# Altium project SZG-TEMPLATE-TXR.PRJPCB
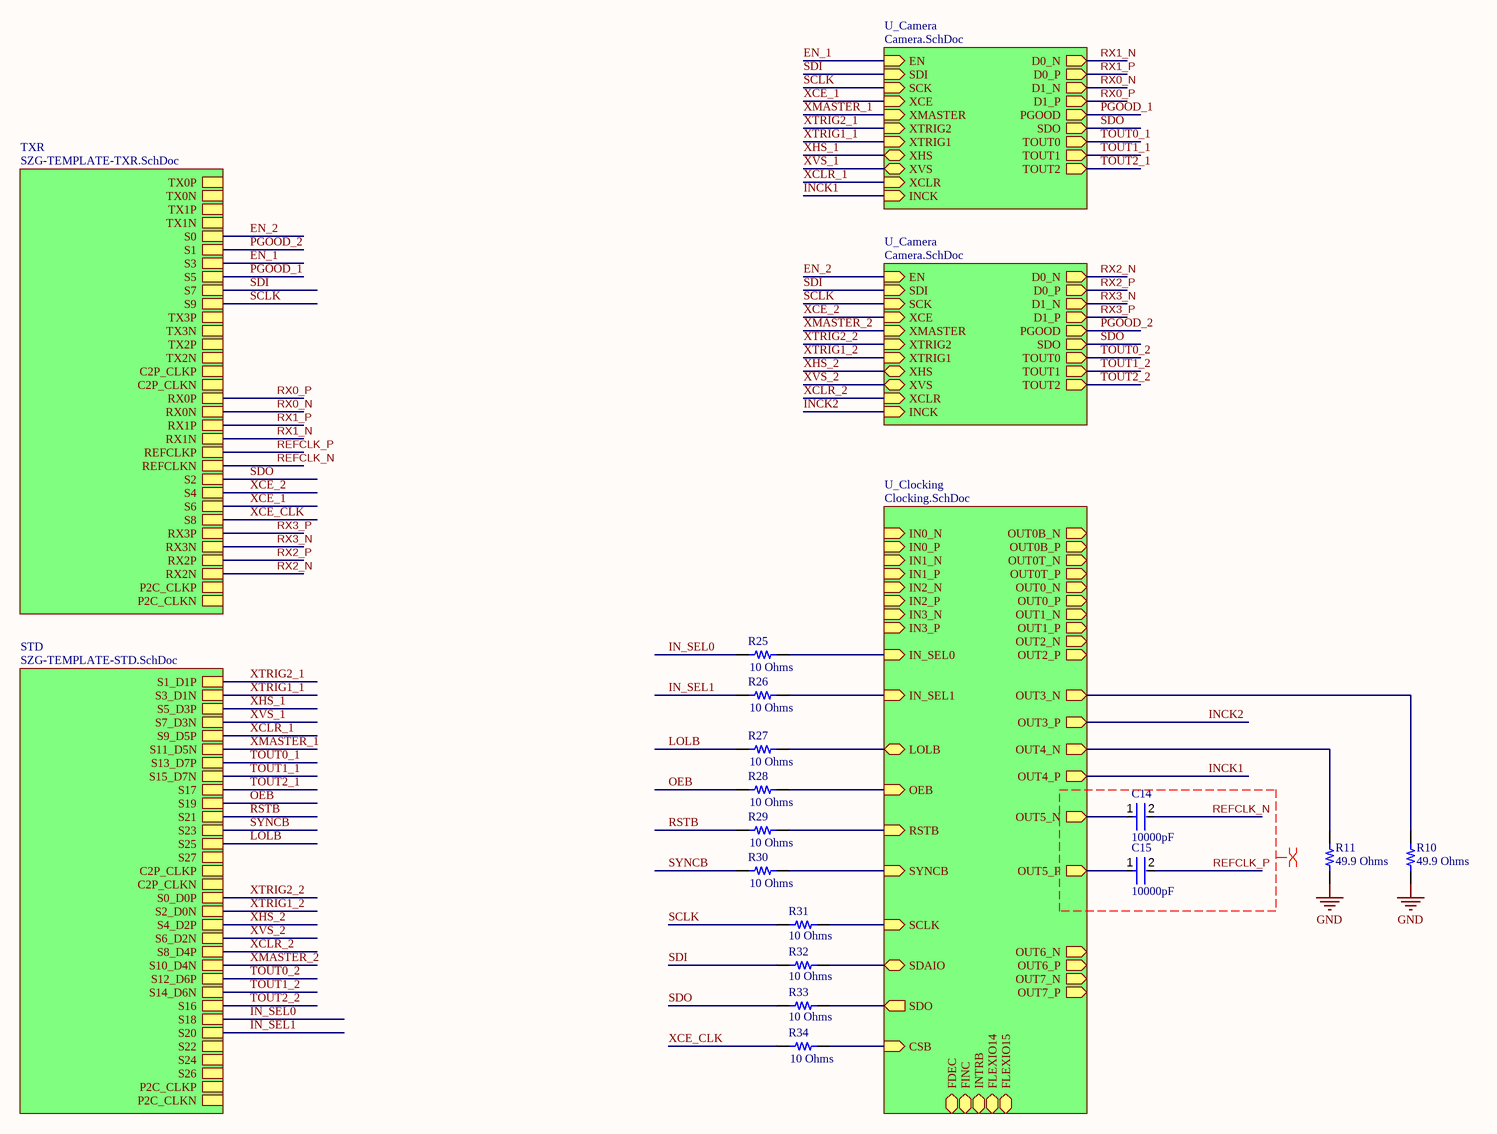
[diagram p0: Main.SchDoc]
7 sheets, 107 parts. Net scope: hierarchical (ports join the sheet entries above them; power ports are global).
Board file: Doublewide.PcbDoc
Sheets:
  Main.SchDoc
    U_Camera = Camera.SchDoc
    U_Clocking = Clocking.SchDoc
      SUPPLY1 = ADP7157-1V8.SchDoc
      SUPPLY3 = ADP151-1V8.SchDoc
      SUPPLY4 = ADP151-1V8.SchDoc
    TXR = SZG-TEMPLATE-TXR.SchDoc
    STD = SZG-TEMPLATE-STD.SchDoc
    U_Camera = Camera.SchDoc

## Sheet Main.SchDoc
size 431 x 279 mm; Organization: ORGANIZATION; Address1: ADDRESS 1; Address2: ADDRESS 2; Address3: ADDRESS 3; Address4: ADDRESS 4; Revision: -; SheetNumber: 1; SheetTotal: 8; ENG_APP_DATE: --/--/--; DSN_APP_DATE: --/--/--; CHK_APP_DATE: --/--/--

### Parts
C14  10000pF  [FP-GRM033-0_03-MFG]
C15  10000pF  [FP-GRM033-0_03-MFG]
R10  49.9 Ohms  [RES 0402_1005]
R11  49.9 Ohms  [RES 0402_1005]
R25  10 Ohms  [RES 0201_0603]
R26  10 Ohms  [RES 0201_0603]
R27  10 Ohms  [RES 0201_0603]
R28  10 Ohms  [RES 0201_0603]
R29  10 Ohms  [RES 0201_0603]
R30  10 Ohms  [RES 0201_0603]
R31  10 Ohms  [RES 0201_0603]
R32  10 Ohms  [RES 0201_0603]
R33  10 Ohms  [RES 0201_0603]
R34  10 Ohms  [RES 0201_0603]

### Sub-sheets
STD = SZG-TEMPLATE-STD.SchDoc: S1_D1P, S3_D1N, S5_D3P, S7_D3N, S9_D5P, S11_D5N, S13_D7P, S15_D7N, S17, S19, S21, S23, S25, S27, C2P_CLKP, C2P_CLKN, S0_D0P, S2_D0N, S4_D2P, S6_D2N, S8_D4P, S10_D4N, S12_D6P, S14_D6N, S16, S18, S20, S22, S24, S26, P2C_CLKP, P2C_CLKN
TXR = SZG-TEMPLATE-TXR.SchDoc: TX0P, TX0N, TX1P, TX1N, S0, S1, S3, S5, S7, S9, TX3P, TX3N, TX2P, TX2N, C2P_CLKP, C2P_CLKN, RX0P, RX0N, RX1P, RX1N, REFCLKP, REFCLKN, S2, S4, S6, S8, RX3P, RX3N, RX2P, RX2N, P2C_CLKP, P2C_CLKN
U_Camera = Camera.SchDoc: D0_N (out), D0_P (out), D1_N (out), D1_P (out), EN (in), PGOOD (out), SDI (in), SCK (in), SDO (out), XCE (in), XMASTER (in), TOUT0 (out), TOUT1 (out), TOUT2 (out), XTRIG2 (in), XTRIG1 (in), XHS (bidir), XVS (bidir), XCLR (in), INCK (in)
U_Camera = Camera.SchDoc: D0_N (out), D0_P (out), D1_N (out), D1_P (out), EN (in), PGOOD (out), SDI (in), SCK (in), SDO (out), XCE (in), XMASTER (in), TOUT0 (out), TOUT1 (out), TOUT2 (out), XTRIG2 (in), XTRIG1 (in), XHS (bidir), XVS (bidir), XCLR (in), INCK (in)
U_Clocking = Clocking.SchDoc: CSB (in), FDEC (bidir), FINC (bidir), FLEXIO14 (bidir), FLEXIO15 (bidir), INTRB (bidir), IN_SEL0 (in), IN_SEL1 (in), LOLB (bidir), OEB (in), RSTB (in), SCLK (in), SDAIO (bidir), SDO (out), SYNCB (in), OUT0B_N (out), OUT0B_P (out), OUT0T_N (out), OUT0T_P (out), OUT0_N (out), OUT0_P (out), OUT1_N (out), OUT1_P (out), OUT2_N (out), OUT2_P (out), OUT3_N (out), OUT3_P (out), OUT4_N (out), OUT4_P (out), OUT5_N (out), OUT5_P (out), OUT6_N (out), OUT6_P (out), OUT7_N (out), OUT7_P (out), IN0_N (in), IN0_P (in), IN1_N (in), IN1_P (in), IN2_N (in), IN2_P (in), IN3_N (in), IN3_P (in)

### Nets
GND: R10.1 R11.1
CSB: R34.2 ; sheet U_Clocking/CSB
EN_1: sheet U_Camera/EN, sheet TXR/S3
EN_2: sheet TXR/S0, sheet U_Camera/EN
IN_SEL0: R25.2 ; sheet U_Clocking/IN_SEL0
IN_SEL0: R25.1 ; sheet STD/S18  [a separate net that carries the same name]
IN_SEL1: R26.2 ; sheet U_Clocking/IN_SEL1
IN_SEL1: R26.1 ; sheet STD/S20  [a separate net that carries the same name]
INCK1: sheet U_Camera/INCK, sheet U_Clocking/OUT4_P
INCK2: sheet U_Clocking/OUT3_P, sheet U_Camera/INCK
LOLB: R27.2 ; sheet U_Clocking/LOLB
LOLB: R27.1 ; sheet STD/S25  [a separate net that carries the same name]
OEB: R28.2 ; sheet U_Clocking/OEB
OEB: R28.1 ; sheet STD/S19  [a separate net that carries the same name]
OUT3_N: R10.2 ; sheet U_Clocking/OUT3_N
OUT4_N: R11.2 ; sheet U_Clocking/OUT4_N
OUT5_N: C14.1 ; sheet U_Clocking/OUT5_N
OUT5_P: C15.1 ; sheet U_Clocking/OUT5_P
PGOOD_1: sheet U_Camera/PGOOD, sheet TXR/S5
PGOOD_2: sheet TXR/S1, sheet U_Camera/PGOOD
REFCLK_N: C14.2 ; sheet TXR/REFCLKN
REFCLK_P: C15.2 ; sheet TXR/REFCLKP
RSTB: R29.2 ; sheet U_Clocking/RSTB
RSTB: R29.1 ; sheet STD/S21  [a separate net that carries the same name]
RX0_N: sheet U_Camera/D1_N, sheet TXR/RX0N
RX0_P: sheet U_Camera/D1_P, sheet TXR/RX0P
RX1_N: sheet U_Camera/D0_N, sheet TXR/RX1N
RX1_P: sheet U_Camera/D0_P, sheet TXR/RX1P
RX2_N: sheet TXR/RX2N, sheet U_Camera/D0_N
RX2_P: sheet TXR/RX2P, sheet U_Camera/D0_P
RX3_N: sheet TXR/RX3N, sheet U_Camera/D1_N
RX3_P: sheet TXR/RX3P, sheet U_Camera/D1_P
SCLK: R31.2 ; sheet U_Clocking/SCLK
SCLK: R31.1 ; sheet U_Camera/SCK, sheet TXR/S9, sheet U_Camera/SCK  [a separate net that carries the same name]
SDAIO: R32.2 ; sheet U_Clocking/SDAIO
SDI: R32.1 ; sheet U_Camera/SDI, sheet TXR/S7, sheet U_Camera/SDI
SDO: R33.2 ; sheet U_Clocking/SDO
SDO: R33.1 ; sheet U_Camera/SDO, sheet TXR/S2, sheet U_Camera/SDO  [a separate net that carries the same name]
SYNCB: R30.2 ; sheet U_Clocking/SYNCB
SYNCB: R30.1 ; sheet STD/S23  [a separate net that carries the same name]
TOUT0_1: sheet U_Camera/TOUT0, sheet STD/S13_D7P
TOUT0_2: sheet STD/S12_D6P, sheet U_Camera/TOUT0
TOUT1_1: sheet U_Camera/TOUT1, sheet STD/S15_D7N
TOUT1_2: sheet STD/S14_D6N, sheet U_Camera/TOUT1
TOUT2_1: sheet U_Camera/TOUT2, sheet STD/S17
TOUT2_2: sheet STD/S16, sheet U_Camera/TOUT2
XCE_1: sheet U_Camera/XCE, sheet TXR/S6
XCE_2: sheet TXR/S4, sheet U_Camera/XCE
XCE_CLK: R34.1 ; sheet TXR/S8
XCLR_1: sheet U_Camera/XCLR, sheet STD/S9_D5P
XCLR_2: sheet STD/S8_D4P, sheet U_Camera/XCLR
XHS_1: sheet U_Camera/XHS, sheet STD/S5_D3P
XHS_2: sheet STD/S4_D2P, sheet U_Camera/XHS
XMASTER_1: sheet U_Camera/XMASTER, sheet STD/S11_D5N
XMASTER_2: sheet STD/S10_D4N, sheet U_Camera/XMASTER
XTRIG1_1: sheet U_Camera/XTRIG1, sheet STD/S3_D1N
XTRIG1_2: sheet STD/S2_D0N, sheet U_Camera/XTRIG1
XTRIG2_1: sheet U_Camera/XTRIG2, sheet STD/S1_D1P
XTRIG2_2: sheet STD/S0_D0P, sheet U_Camera/XTRIG2
XVS_1: sheet U_Camera/XVS, sheet STD/S7_D3N
XVS_2: sheet STD/S6_D2N, sheet U_Camera/XVS

### Layout directives
differential pair; net class REFCLK; differential pair class REFCLK: REFCLK_N, REFCLK_P

### Notes on the sheet
- DWG. NO.
- REV.
- SHT.
- REVISION
- DESCRIPTION
- DATE
- APPROVED
- ENG:
- APPROVALS
- PROJECT
- DSN:
- CHK:
- REFERENCE DOCUMENTS
- PROJECT REVISION:
- TITLE
- SimulaVR
- DOCUMENT REVISION:
- DESIGN ITEM:
- BOM:
- FAB DWG:
- PCB DWG:
- ASSY DWG:
- SCALE:
- SIZE
- B
- CAGE CODE
- FILE NAME
- DWG NO.
- SHEET
- OF
- REV

### Library data of the parts
C14 C15 = CMP-001-00084-1: CAP CER 10000PF 25V X5R 0201
R10 R11 = ERJ-2RKF49R9X: RES SMD 49.9 OHM 1% 1/10W 0402; Manufacturer: Panasonic Electronic Components; Power (Watts): 0.1W, 1/10W; Temperature Coefficient: ±100ppm/°C; Part Number: ERJ-2RKF49R9X; Value: 49.9 Ohms; ComponentLink1Description: Datasheet; ComponentLink1URL: https://industrial.panasonic.com/cdbs/www-data/pdf/RDA0000/AOA0000C304.pdf; ComponentLink2Description: DigiKey Link; ComponentLink2URL: https://www.digikey.com/en/products/detail/panasonic-electronic-components/ERJ-2RKF49R9X/192382; Composition: Thick Film; Device Package: 0402 (1005 Metric); Features: Automotive AEC-Q200; Height - Seated (Max): 0.016" (0.40mm); LastUpdated: 8/11/2022 9:07:22 AM; Lifecycle Status: Active; Minimum Order: 1; Number of Terminations: 2; Operating Temperature: -55°C ~ 155°C; Package / Case: 0402 (1005 Metric); Packaging: CutTape; PartId: 17623; Part Status: Active; Price: 0.01; Ratings: AEC-Q200; Resistance: 49.9 Ohms; Series: ERJ-2RK; Size / Dimension: 0.039" L x 0.020" W (1.00mm x 0.50mm); Supplier 1: DigiKey; Supplier Part Number 1: P49.9LCT-ND; Supplier Device Package: 0402; Tolerance: ±1%
R25-R34 = CRG0201F10R: RES SMD 10 OHM 1% 1/20W 0201; Manufacturer: TE Connectivity Passive Product; Power (Watts): 0.05W, 1/20W; Temperature Coefficient: ±400ppm/°C; Part Number: CRG0201F10R; Value: 10 Ohms; ComponentLink1Description: Datasheet; ComponentLink1URL: https://www.te.com/commerce/DocumentDelivery/DDEController?Action=srchrtrv&DocNm=1773204&DocType=DS&DocLang=English; ComponentLink2Description: DigiKey Link; ComponentLink2URL: https://www.digikey.com/en/products/detail/te-connectivity-passive-product/CRG0201F10R/4489648; Composition: Thick Film; Device Package: 0201 (0603 Metric); Height - Seated (Max): 0.010" (0.26mm); LastUpdated: 8/11/2022 9:03:27 AM; Lifecycle Status: Active; Minimum Order: 1; Number of Terminations: 2; Operating Temperature: -55°C ~ 155°C; Package / Case: 0201 (0603 Metric); Packaging: TapeAndReel; PartId: 3; Part Status: Active; Price: 0.03; Resistance: 10 Ohms; Series: CRG, Neohm; Size / Dimension: 0.024" L x 0.012" W (0.60mm x 0.30mm); Supplier 1: DigiKey; Supplier Part Number 1: A129573CT-ND; Supplier Device Package: 0201; Tolerance: ±1%

## Sheet Camera.SchDoc
size 431 x 279 mm; Organization: ORGANIZATION; Address1: ADDRESS 1; Address2: ADDRESS 2; Address3: ADDRESS 3; Address4: ADDRESS 4; Revision: -; SheetNumber: 4; SheetTotal: 8; ENG_APP_DATE: --/--/--; DSN_APP_DATE: --/--/--; CHK_APP_DATE: --/--/--
Used 2 times, as channels U_Camera, U_Camera. Parts and nets are listed once, with the designators drawn on the sheet.
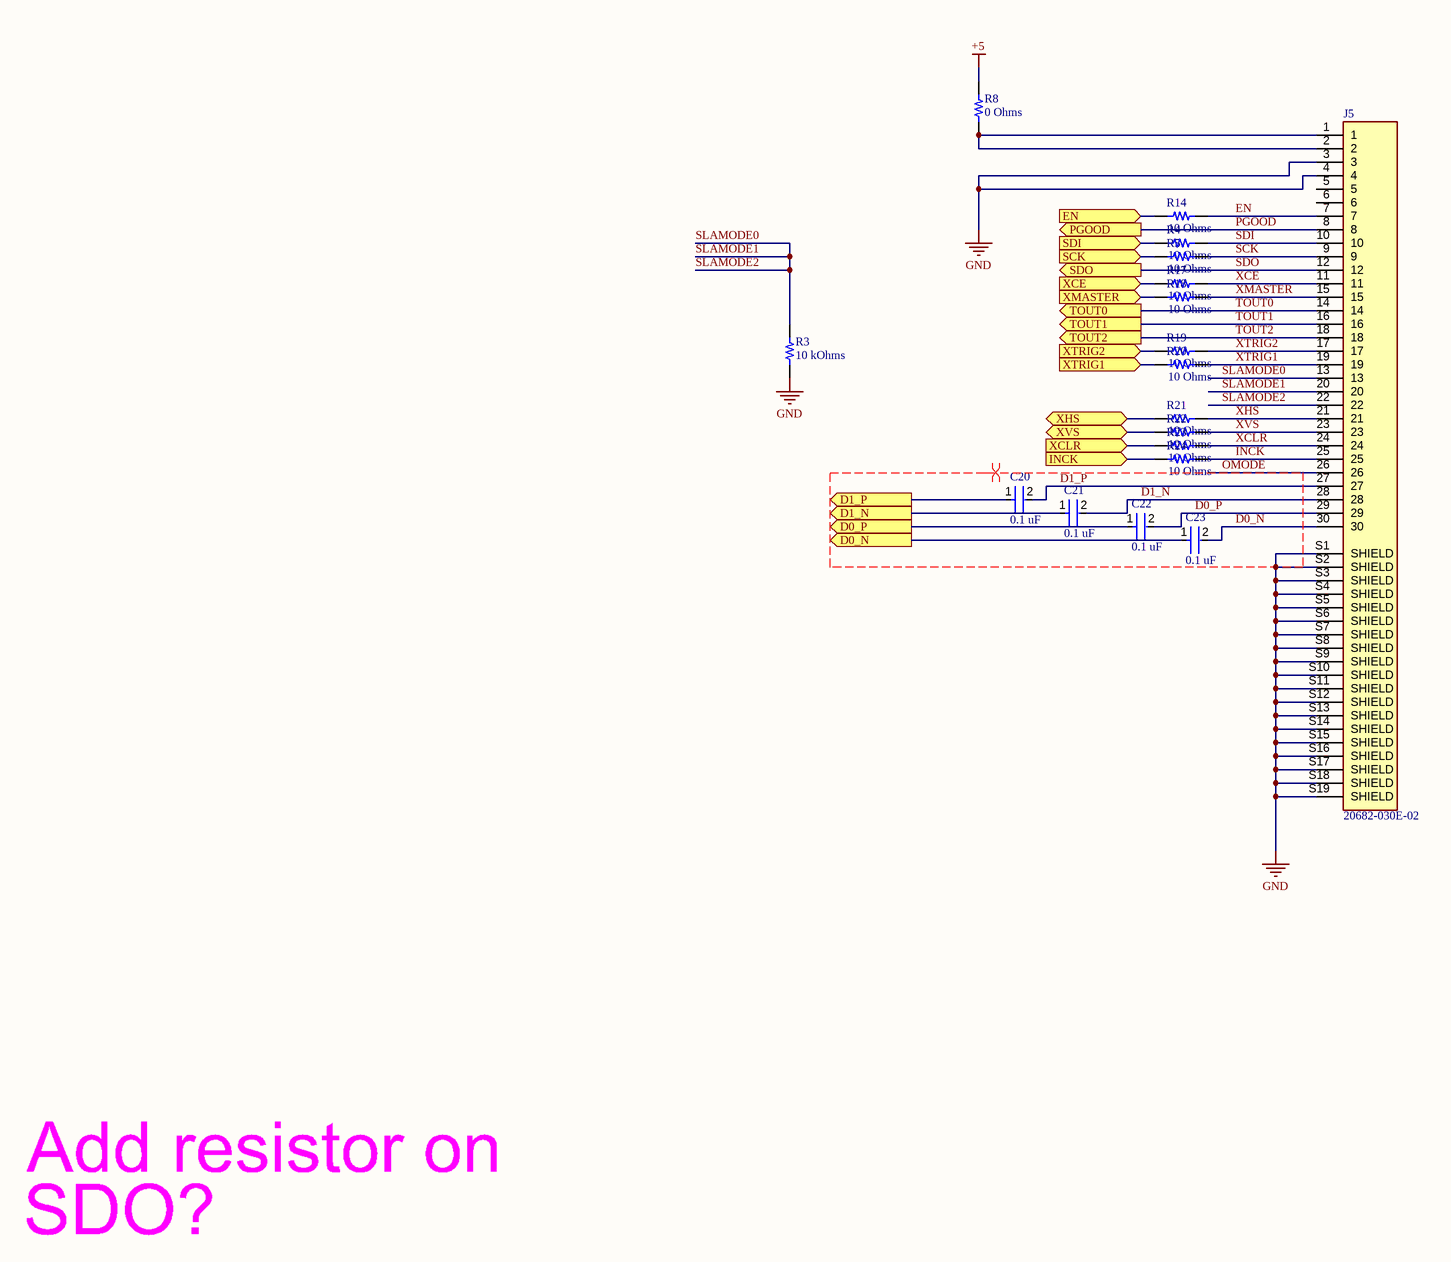
[diagram p1: Camera.SchDoc]

### Parts
C20  0.1 uF  [FP-GRM033-0_03-MFG]
C21  0.1 uF  [FP-GRM033-0_03-MFG]
C22  0.1 uF  [FP-GRM033-0_03-MFG]
C23  0.1 uF  [FP-GRM033-0_03-MFG]
J5  20682-030E-02  [IPEX_20682-030E-02]
R3  10 kOhms  [RES 0201_0603]
R4  10 Ohms  [RES 0201_0603]
R5  10 Ohms  [RES 0201_0603]
R8  0 Ohms  [RES 0402_1005]
R14  10 Ohms  [RES 0201_0603]
R17  10 Ohms  [RES 0201_0603]
R18  10 Ohms  [RES 0201_0603]
R19  10 Ohms  [RES 0201_0603]
R20  10 Ohms  [RES 0201_0603]
R21  10 Ohms  [RES 0201_0603]
R22  10 Ohms  [RES 0201_0603]
R23  10 Ohms  [RES 0201_0603]
R24  10 Ohms  [RES 0201_0603]

### Ports
D0_N (out), D0_P (out), D1_N (out), D1_P (out), EN (in), INCK (in), PGOOD (out), SCK (in), SDI (in), SDO (out), TOUT0 (out), TOUT1 (out), TOUT2 (out), XCE (in), XCLR (in), XHS (bidir), XMASTER (in), XTRIG1 (in), XTRIG2 (in), XVS (bidir)

### Nets
+5: R8.2
GND: J5.3 J5.4 J5.S1(SHIELD) J5.S2(SHIELD) J5.S3(SHIELD) J5.S4(SHIELD) J5.S5(SHIELD) J5.S6(SHIELD) J5.S7(SHIELD) J5.S8(SHIELD) J5.S9(SHIELD) J5.S10(SHIELD) J5.S11(SHIELD) J5.S12(SHIELD) J5.S13(SHIELD) J5.S14(SHIELD) J5.S15(SHIELD) J5.S16(SHIELD) J5.S17(SHIELD) J5.S18(SHIELD) J5.S19(SHIELD) R3.1
D0_N: C23.2 J5.30  [project net D0_N_4]
D0_N: C23.1 ; port D0_N  [a separate net that carries the same name]
D0_P: C22.2 J5.29  [project net D0_P_4]
D0_P: C22.1 ; port D0_P  [a separate net that carries the same name]
D1_N: C21.2 J5.28  [project net D1_N_4]
D1_N: C21.1 ; port D1_N  [a separate net that carries the same name]
D1_P: C20.2 J5.27  [project net D1_P_4]
D1_P: C20.1 ; port D1_P  [a separate net that carries the same name]
EN: J5.7 R14.2  [project net EN_4]
EN: R14.1 ; port EN  [a separate net that carries the same name]
INCK: J5.25 R24.2  [project net INCK_4]
INCK: R24.1 ; port INCK  [a separate net that carries the same name]
OMODE: J5.26  [project net OMODE_4]
PGOOD: J5.8 ; port PGOOD
SCK: J5.9 R5.2  [project net SCK_4]
SCK: R5.1 ; port SCK  [a separate net that carries the same name]
SDI: J5.10 R4.2  [project net SDI_4]
SDI: R4.1 ; port SDI  [a separate net that carries the same name]
SDO: J5.12 ; port SDO
SLAMODE0: J5.13 J5.20 J5.22 R3.2  [also labelled SLAMODE1, SLAMODE2]  [project net SLAMODE0_4]
TOUT0: J5.14 ; port TOUT0
TOUT1: J5.16 ; port TOUT1
TOUT2: J5.18 ; port TOUT2
XCE: J5.11 R17.2  [project net XCE_4]
XCE: R17.1 ; port XCE  [a separate net that carries the same name]
XCLR: J5.24 R23.2  [project net XCLR_4]
XCLR: R23.1 ; port XCLR  [a separate net that carries the same name]
XHS: J5.21 R21.2  [project net XHS_4]
XHS: R21.1 ; port XHS  [a separate net that carries the same name]
XMASTER: J5.15 R18.2  [project net XMASTER_4]
XMASTER: R18.1 ; port XMASTER  [a separate net that carries the same name]
XTRIG1: J5.19 R20.2  [project net XTRIG1_4]
XTRIG1: R20.1 ; port XTRIG1  [a separate net that carries the same name]
XTRIG2: J5.17 R19.2  [project net XTRIG2_4]
XTRIG2: R19.1 ; port XTRIG2  [a separate net that carries the same name]
XVS: J5.23 R22.2  [project net XVS_4]
XVS: R22.1 ; port XVS  [a separate net that carries the same name]
NetJ5_1: J5.1 J5.2 R8.1

Not connected (* = marked no-connect by the designer): J5 5 6

### Channels
U_Camera: designators C20=C20_U_Camera#1 C21=C21_U_Camera#1 C22=C22_U_Camera#1 C23=C23_U_Camera#1 J5=J5_U_Camera2 R3=R3_U_Camera2 R4=R4_U_Camera#1 R5=R5_U_Camera#1 R8=R8_U_Camera#1 R14=R14_U_Camera2 R17=R17_U_Camera2 R18=R18_U_Camera2 R19=R19_U_Camera2 R20=R20_U_Camera2 R21=R21_U_Camera2 R22=R22_U_Camera2 R23=R23_U_Camera2 R24=R24_U_Camera2; ports D0_N=RX1_N D0_P=RX1_P D1_N=RX0_N D1_P=RX0_P EN=EN_1 INCK=INCK1 PGOOD=PGOOD_1 SCK=SCLK SDI=SDI SDO=SDO TOUT0=TOUT0_1 TOUT1=TOUT1_1 TOUT2=TOUT2_1 XCE=XCE_1 XCLR=XCLR_1 XHS=XHS_1 XMASTER=XMASTER_1 XTRIG1=XTRIG1_1 XTRIG2=XTRIG2_1 XVS=XVS_1
U_Camera: designators C20=C20_U_Camera#2 C21=C21_U_Camera#2 C22=C22_U_Camera#2 C23=C23_U_Camera#2 J5=J5_U_Camera1 R3=R3_U_Camera1 R4=R4_U_Camera#2 R5=R5_U_Camera#2 R8=R8_U_Camera#2 R14=R14_U_Camera1 R17=R17_U_Camera1 R18=R18_U_Camera1 R19=R19_U_Camera1 R20=R20_U_Camera1 R21=R21_U_Camera1 R22=R22_U_Camera1 R23=R23_U_Camera1 R24=R24_U_Camera1; ports D0_N=RX2_N D0_P=RX2_P D1_N=RX3_N D1_P=RX3_P EN=EN_2 INCK=INCK2 PGOOD=PGOOD_2 SCK=SCLK SDI=SDI SDO=SDO TOUT0=TOUT0_2 TOUT1=TOUT1_2 TOUT2=TOUT2_2 XCE=XCE_2 XCLR=XCLR_2 XHS=XHS_2 XMASTER=XMASTER_2 XTRIG1=XTRIG1_2 XTRIG2=XTRIG2_2 XVS=XVS_2

### Layout directives
differential pair; net class SLVS-EC; differential pair class SLVS-EC: D0_N, D0_P, D1_N, D1_P, OMODE

### Notes on the sheet
- DWG. NO.
- REV.
- SHT.
- REVISION
- DESCRIPTION
- DATE
- APPROVED
- ENG:
- APPROVALS
- PROJECT
- DSN:
- CHK:
- REFERENCE DOCUMENTS
- PROJECT REVISION:
- TITLE
- SimulaVR
- DOCUMENT REVISION:
- DESIGN ITEM:
- BOM:
- FAB DWG:
- PCB DWG:
- ASSY DWG:
- SCALE:
- SIZE
- B
- CAGE CODE
- FILE NAME
- DWG NO.
- SHEET
- OF
- REV

### Library data of the parts
C20-C23 = CMP-001-00083-1: GRM033R61E104KE14D CAP CER 0.1UF 10V X5R 0201
J5 = CMP-004-000000-1: Cabline-CAII Rece. Ass'y; MF: {'manufacturer': u'I-PEX'}; Availability: Unavailable; Price: None; MP: 20682-030E-02; Design Item ID: 20682-030E-02; Source: 20682-030E-02.SchLib; Package: None; Value: *
R3 = ERJ-U01J103C: RES 10K OHM 5% 1/20W 0201 SMD; Manufacturer: Panasonic Electronic Components; Power (Watts): 0.05W, 1/20W; Temperature Coefficient: ±200ppm/°C; Part Number: ERJ-U01J103C; Value: 10 kOhms; ComponentLink1Description: Datasheet; ComponentLink1URL: https://industrial.panasonic.com/cdbs/www-data/pdf/RDP0000/AOA0000C334.pdf; ComponentLink2Description: DigiKey Link; ComponentLink2URL: https://www.digikey.com/en/products/detail/panasonic-electronic-components/ERJ-U01J103C/11635419; Composition: Thick Film; Device Package: 0201 (0603 Metric); Features: Anti-Sulfur; Height - Seated (Max): 0.010" (0.26mm); LastUpdated: 5/23/2022 1:02:10 PM; Lifecycle Status: Active; Minimum Order: 1; Number of Terminations: 2; Operating Temperature: -55°C ~ 125°C; Package / Case: 0201 (0603 Metric); Packaging: TapeAndReel; PartId: 57694; Part Status: Active; Price: 0.03; Resistance: 10 kOhms; Series: ERJ-U01; Size / Dimension: 0.024" L x 0.012" W (0.60mm x 0.30mm); Supplier 1: DigiKey; Supplier Part Number 1: 10-ERJ-U01J103CCT-ND; Supplier Device Package: 0201; Tolerance: ±5%
R4 R5 R14 R17-R24 = CRG0201F10R: as R25 on sheet Main; Part Number: CRG0201F10R; Value: 10 Ohms; ComponentLink1Description: Datasheet; ComponentLink1URL: https://www.te.com/commerce/DocumentDelivery/DDEController?Action=srchrtrv&DocNm=1773204&DocType=DS&DocLang=English; ComponentLink2Description: DigiKey Link; ComponentLink2URL: https://www.digikey.com/en/products/detail/te-connectivity-passive-product/CRG0201F10R/4489648; Composition: Thick Film; Device Package: 0201 (0603 Metric); Height - Seated (Max): 0.010" (0.26mm); LastUpdated: 8/11/2022 9:03:27 AM; Lifecycle Status: Active; Minimum Order: 1; Number of Terminations: 2; Operating Temperature: -55°C ~ 155°C; Package / Case: 0201 (0603 Metric); Packaging: TapeAndReel; PartId: 3; Part Status: Active; Price: 0.03; Resistance: 10 Ohms; Series: CRG, Neohm; Size / Dimension: 0.024" L x 0.012" W (0.60mm x 0.30mm); Supplier 1: DigiKey; Supplier Part Number 1: A129573CT-ND; Supplier Device Package: 0201; Tolerance: ±1%
R8 = CRCW04020000Z0EDHP: RES SMD 0 OHM JUMPER 1/5W 0402; Manufacturer: Vishay Dale; Power (Watts): 0.2W, 1/5W; Part Number: CRCW04020000Z0EDHP; Value: 0 Ohms; ComponentLink1Description: Datasheet; ComponentLink1URL: http://www.vishay.com/docs/20043/crcwhpe3.pdf; ComponentLink2Description: DigiKey Link; ComponentLink2URL: https://www.digikey.com/en/products/detail/vishay-dale/CRCW04020000Z0EDHP/2222496; Composition: Thick Film; Device Package: 0402 (1005 Metric); Features: Automotive AEC-Q200, Pulse Withstanding; Height - Seated (Max): 0.016" (0.40mm); LastUpdated: 01.09.2022 12:46:55; Lifecycle Status: Active; Minimum Order: 1; Number of Terminations: 2; Operating Temperature: -55°C ~ 155°C; Package / Case: 0402 (1005 Metric); Packaging: TapeAndReel; PartId: 3131; Part Status: Active; Price: 0.01; Ratings: AEC-Q200; Resistance: 0 Ohms; Series: CRCW-HP; Size / Dimension: 0.039" L x 0.020" W (1.00mm x 0.50mm); Supplier 1: DigiKey; Supplier Part Number 1: 541-0.0YBCT-ND; Supplier Device Package: 0402; Tolerance: Jumper

## Sheet Clocking.SchDoc
size 431 x 279 mm; Organization: ORGANIZATION; Address1: ADDRESS 1; Address2: ADDRESS 2; Address3: ADDRESS 3; Address4: ADDRESS 4; Revision: -; SheetNumber: 5; SheetTotal: 8; ENG_APP_DATE: --/--/--; DSN_APP_DATE: --/--/--; CHK_APP_DATE: --/--/--
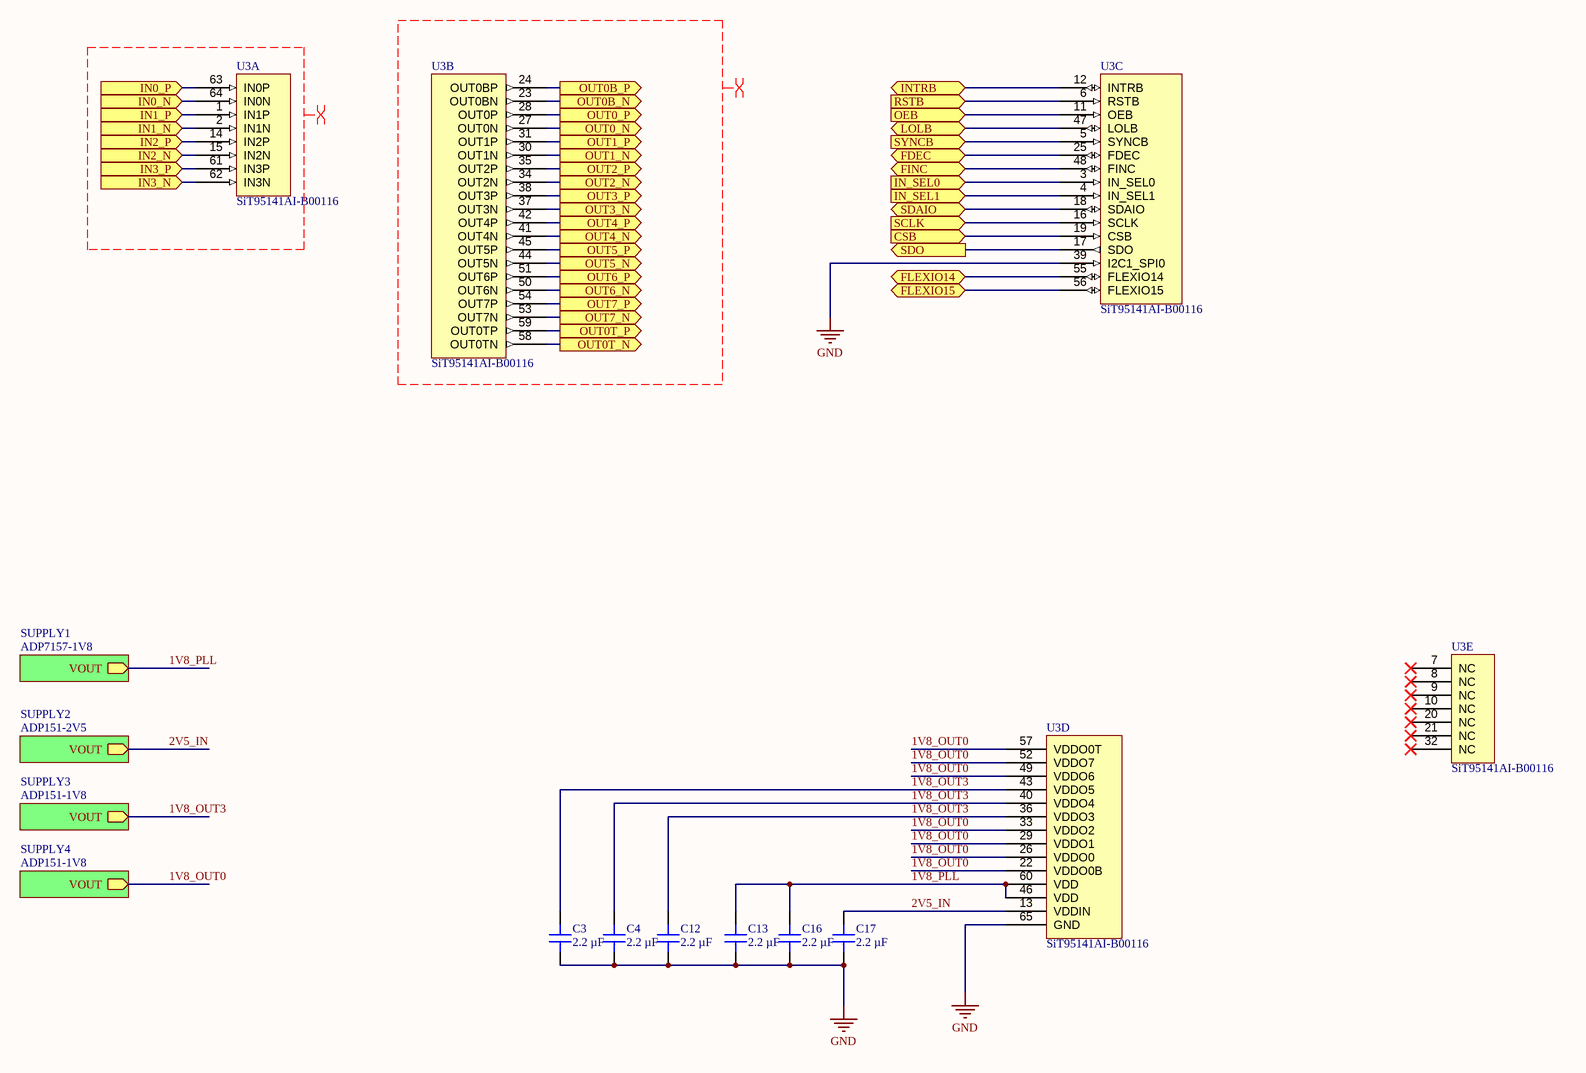
[diagram p2: Clocking.SchDoc]

### Parts
C3  2.2 µF  [CAP 0201_0603]
C4  2.2 µF  [CAP 0201_0603]
C12  2.2 µF  [CAP 0201_0603]
C13  2.2 µF  [CAP 0201_0603]
C16  2.2 µF  [CAP 0201_0603]
C17  2.2 µF  [CAP 0201_0603]
U3  SiT95141AI-B00116  [QFN50P900X900X90_HS-65N]  (parts A,B,C,D,E of 5)

### Sub-sheets
SUPPLY1 = ADP7157-1V8: VOUT (out)
SUPPLY2 = ADP151-2V5 (file not in this document): VOUT (out)
SUPPLY3 = ADP151-1V8: VOUT (out)
SUPPLY4 = ADP151-1V8: VOUT (out)

### Ports
CSB (in), FDEC (bidir), FINC (bidir), FLEXIO14 (bidir), FLEXIO15 (bidir), IN0_N (in), IN0_P (in), IN1_N (in), IN1_P (in), IN2_N (in), IN2_P (in), IN3_N (in), IN3_P (in), IN_SEL0 (in), IN_SEL1 (in), INTRB (bidir), LOLB (bidir), OEB (in), OUT0_N (out), OUT0_P (out), OUT0B_N (out), OUT0B_P (out), OUT0T_N (out), OUT0T_P (out), OUT1_N (out), OUT1_P (out), OUT2_N (out), OUT2_P (out), OUT3_N (out), OUT3_P (out), OUT4_N (out), OUT4_P (out), OUT5_N (out), OUT5_P (out), OUT6_N (out), OUT6_P (out), OUT7_N (out), OUT7_P (out), RSTB (in), SCLK (in), SDAIO (bidir), SDO (out), SYNCB (in)

### Nets
GND: C3.1 C4.1 C12.1 C13.1 C16.1 C17.1 U3.39(I2C1_SPI0) U3.65(GND)
1V8_OUT0: U3.22(VDDO0B) U3.26(VDDO0) U3.29(VDDO1) U3.33(VDDO2) U3.49(VDDO6) U3.52(VDDO7) U3.57(VDDO0T) ; sheet SUPPLY4/VOUT
1V8_OUT3: C3.2 C4.2 C12.2 U3.36(VDDO3) U3.40(VDDO4) U3.43(VDDO5) ; sheet SUPPLY3/VOUT
1V8_PLL: C13.2 C16.2 U3.46(VDD) U3.60(VDD) ; sheet SUPPLY1/VOUT
2V5_IN: C17.2 U3.13(VDDIN) ; sheet SUPPLY2/VOUT
CSB: U3.19(CSB) ; port CSB
FDEC: U3.25(FDEC) ; port FDEC
FINC: U3.48(FINC) ; port FINC
FLEXIO14: U3.55(FLEXIO14) ; port FLEXIO14
FLEXIO15: U3.56(FLEXIO15) ; port FLEXIO15
IN0_N: U3.64(IN0N) ; port IN0_N
IN0_P: U3.63(IN0P) ; port IN0_P
IN1_N: U3.2(IN1N) ; port IN1_N
IN1_P: U3.1(IN1P) ; port IN1_P
IN2_N: U3.15(IN2N) ; port IN2_N
IN2_P: U3.14(IN2P) ; port IN2_P
IN3_N: U3.62(IN3N) ; port IN3_N
IN3_P: U3.61(IN3P) ; port IN3_P
IN_SEL0: U3.3(IN_SEL0) ; port IN_SEL0
IN_SEL1: U3.4(IN_SEL1) ; port IN_SEL1
INCK1: U3.42(OUT4P) ; port OUT4_P
INCK2: U3.38(OUT3P) ; port OUT3_P
INTRB: U3.12(INTRB) ; port INTRB
LOLB: U3.47(LOLB) ; port LOLB
OEB: U3.11(OEB) ; port OEB
OUT0_N: U3.27(OUT0N) ; port OUT0_N
OUT0_P: U3.28(OUT0P) ; port OUT0_P
OUT0B_N: U3.23(OUT0BN) ; port OUT0B_N
OUT0B_P: U3.24(OUT0BP) ; port OUT0B_P
OUT0T_N: U3.58(OUT0TN) ; port OUT0T_N
OUT0T_P: U3.59(OUT0TP) ; port OUT0T_P
OUT1_N: U3.30(OUT1N) ; port OUT1_N
OUT1_P: U3.31(OUT1P) ; port OUT1_P
OUT2_N: U3.34(OUT2N) ; port OUT2_N
OUT2_P: U3.35(OUT2P) ; port OUT2_P
OUT3_N: U3.37(OUT3N) ; port OUT3_N
OUT4_N: U3.41(OUT4N) ; port OUT4_N
OUT5_N: U3.44(OUT5N) ; port OUT5_N
OUT5_P: U3.45(OUT5P) ; port OUT5_P
OUT6_N: U3.50(OUT6N) ; port OUT6_N
OUT6_P: U3.51(OUT6P) ; port OUT6_P
OUT7_N: U3.53(OUT7N) ; port OUT7_N
OUT7_P: U3.54(OUT7P) ; port OUT7_P
RSTB: U3.6(RSTB) ; port RSTB
SCLK: U3.16(SCLK) ; port SCLK
SDAIO: U3.18(SDAIO) ; port SDAIO
SDO: U3.17(SDO) ; port SDO
SYNCB: U3.5(SYNCB) ; port SYNCB

Not connected (* = marked no-connect by the designer): U3 7(NC)* 8(NC)* 9(NC)* 10(NC)* 20(NC)* 21(NC)* 32(NC)*

### Layout directives
differential pair; net class REFCLK; differential pair class REFCLK: (no net found under the mark)

### Notes on the sheet
- DWG. NO.
- REV.
- SHT.
- REVISION
- DESCRIPTION
- DATE
- APPROVED
- ENG:
- APPROVALS
- PROJECT
- DSN:
- CHK:
- REFERENCE DOCUMENTS
- PROJECT REVISION:
- TITLE
- SimulaVR
- DOCUMENT REVISION:
- DESIGN ITEM:
- BOM:
- FAB DWG:
- PCB DWG:
- ASSY DWG:
- SCALE:
- SIZE
- B
- CAGE CODE
- FILE NAME
- DWG NO.
- SHEET
- OF
- REV

### Library data of the parts
C3 C4 C12 C13 C16 C17 = GRM033R60J225ME15D: CAP CER 2.2UF 6.3V X5R 0201; manufacturer: Murata Electronics; Tolerance: ±20%; Part Number: GRM033R60J225ME15D; Value: 2.2 µF; Applications: General Purpose; Capacitance: 2.2 µF; componentlink1description: Datasheet; componentlink1url: https://www.murata.com/~/media/webrenewal/support/library/catalog/products/capacitor/mlcc/c02e.ashx?la=en-us; componentlink2description: DigiKey Link; componentlink2url: https://www.digikey.com/en/products/detail/murata-electronics/GRM033R60J225ME15D/5877387; Device Package: 0201 (0603 Metric); lastupdated: 8/14/2022 9:02:48 PM; Lifecycle Status: Active; Minimum Order: 1; Mounting Type: Surface Mount, MLCC; Operating Temperature: -55°C ~ 85°C; Package / Case: 0201 (0603 Metric); packaging: TapeAndReel; Part Status: Active; price: 0.04; series: GRM; Size / Dimension: 0.024" L x 0.012" W (0.60mm x 0.30mm); Supplier 1: DigiKey; Supplier Part Number 1: 490-13224-1-ND; Temperature Coefficient: X5R; Thickness (Max): 0.014" (0.35mm); Voltage - Rated: 6.3V; partid: 411
U3 = CMP-023-00000-1

## Sheet ADP7157-1V8.SchDoc
size A3
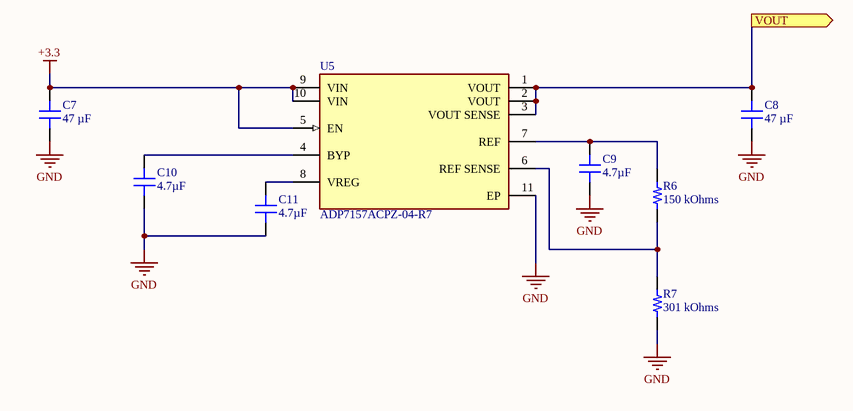
[diagram p3: ADP7157-1V8.SchDoc]

### Parts
C7  47 µF  [CAP 0603_1608]
C8  47 µF  [CAP 0603_1608]
C9  4.7µF  [CAP 0402_1005]
C10  4.7µF  [CAP 0402_1005]
C11  4.7µF  [CAP 0402_1005]
R6  150 kOhms  [RES 0201_0603]
R7  301 kOhms  [RES 0201_0603]
U5  ADP7157ACPZ-04-R7  [FP-CP-10-9-IPC_B]

### Ports
VOUT (out)

### Nets
+3.3: C7.2 U5.5(EN) U5.9(VIN) U5.10(VIN)
GND: C7.1 C8.1 C9.1 C10.1 C11.1 R7.1 U5.11(EP)
1V8_PLL: C8.2 U5.1(VOUT) U5.2(VOUT) U5.3(VOUT_SENSE) ; port VOUT
NetC9_2: C9.2 R6.2 U5.7(REF)
NetC10_2: C10.2 U5.4(BYP)
NetC11_2: C11.2 U5.8(VREG)
NetR6_1: R6.1 R7.2 U5.6(REF_SENSE)

### Library data of the parts
C7 C8 = GRM188R60J476ME01D: CAP CER 47UF 6.3V X5R 0603; manufacturer: Murata Electronics; Tolerance: ±20%; Part Number: GRM188R60J476ME01D; Value: 47 µF; Applications: General Purpose; Capacitance: 47 µF; componentlink2description: DigiKey Link; componentlink2url: https://www.digikey.com/en/products/detail/murata-electronics/GRM188R60J476ME01D/13996874; Device Package: 0603 (1608 Metric); lastupdated: 5/20/2022 2:38:45 PM; Lifecycle Status: Active; Minimum Order: 1; Mounting Type: Surface Mount, MLCC; Operating Temperature: -55°C ~ 85°C; Package / Case: 0603 (1608 Metric); packaging: TapeAndReel; partid: 44498; Part Status: Active; price: 0.10; series: GRM; Size / Dimension: 0.063" L x 0.031" W (1.60mm x 0.80mm); Supplier 1: DigiKey; Supplier Part Number 1: 490-GRM188R60J476ME01DCT-ND; Temperature Coefficient: X5R; Thickness (Max): 0.039" (1.00mm); Voltage - Rated: 6.3V
C9-C11 = GRM155R61A475MEAAD: CAP CER 4.7UF 10V X5R 0402; Manufacturer: Murata Electronics; Tolerance: ±20%; Part Number: GRM155R61A475MEAAD; Value: 4.7µF; Applications: General Purpose; Capacitance: 4.7µF; ComponentLink1Description: Datasheet; ComponentLink1URL: https://search.murata.co.jp/Ceramy/image/img/A01X/G101/ENG/GRM155R61A475MEAA-01.pdf; ComponentLink2Description: DigiKey Link; ComponentLink2URL: https://www.digikey.com/en/products/detail/murata-electronics/GRM155R61A475MEAAD/6234735; Device Package: 0402 (1005 Metric); LastUpdated: 2/8/2022 12:26:50 PM; Lifecycle Status: Active; Minimum Order: 1; Mounting Type: Surface Mount, MLCC; Operating Temperature: -55°C ~ 85°C; Package / Case: 0402 (1005 Metric); Packaging: TapeAndReel; PartId: 6746; Part Status: Active; Price: 0.03; Series: GRM; Size / Dimension: 0.039" L x 0.020" W (1.00mm x 0.50mm); Supplier 1: DigiKey; Supplier Part Number 1: 490-14306-1-ND; Temperature Coefficient: X5R; Thickness (Max): 0.026" (0.65mm); Voltage - Rated: 10V
R6 = ERJ-1GNJ154C: RES SMD 150K OHM 5% 1/20W 0201; Manufacturer: Panasonic Electronic Components; Power (Watts): 0.05W, 1/20W; Temperature Coefficient: ±200ppm/°C; Part Number: ERJ-1GNJ154C; Value: 150 kOhms; ComponentLink1Description: Datasheet; ComponentLink1URL: https://b2b-api.panasonic.eu/file_stream/pids/fileversion/1242; ComponentLink2Description: DigiKey Link; ComponentLink2URL: https://www.digikey.com/en/products/detail/panasonic-electronic-components/ERJ-1GNJ154C/2035839; Composition: Thick Film; Device Package: 0201 (0603 Metric); Features: Automotive AEC-Q200; Height - Seated (Max): 0.010" (0.26mm); LastUpdated: 8/11/2022 9:03:25 AM; Lifecycle Status: Active; Minimum Order: 1; Number of Terminations: 2; Operating Temperature: -55°C ~ 125°C; Package / Case: 0201 (0603 Metric); Packaging: CutTape; PartId: 332; Part Status: Active; Price: 0.01; Ratings: AEC-Q200; Resistance: 150 kOhms; Series: ERJ-1GN; Size / Dimension: 0.024" L x 0.012" W (0.60mm x 0.30mm); Supplier 1: DigiKey; Supplier Part Number 1: P123248CT-ND; Supplier Device Package: 0201; Tolerance: ±5%
R7 = ERJ-1GNF3013C: RES SMD 301K OHM 1% 1/20W 0201; Manufacturer: Panasonic Electronic Components; Power (Watts): 0.05W, 1/20W; Temperature Coefficient: ±200ppm/°C; Part Number: ERJ-1GNF3013C; Value: 301 kOhms; ComponentLink1Description: Datasheet; ComponentLink1URL: https://industrial.panasonic.com/cdbs/www-data/pdf/RDA0000/AOA0000C304.pdf; ComponentLink2Description: DigiKey Link; ComponentLink2URL: https://www.digikey.com/en/products/detail/panasonic-electronic-components/ERJ-1GNF3013C/2036394; Composition: Thick Film; Device Package: 0201 (0603 Metric); Features: Automotive AEC-Q200; Height - Seated (Max): 0.010" (0.26mm); LastUpdated: 8/11/2022 9:03:12 AM; Lifecycle Status: Active; Minimum Order: 1; Number of Terminations: 2; Operating Temperature: -55°C ~ 125°C; Package / Case: 0201 (0603 Metric); Packaging: TapeAndReel; PartId: 2352; Part Status: Active; Price: 0.01; Ratings: AEC-Q200; Resistance: 301 kOhms; Series: ERJ-1GN; Size / Dimension: 0.024" L x 0.012" W (0.60mm x 0.30mm); Supplier 1: DigiKey; Supplier Part Number 1: P122918CT-ND; Supplier Device Package: 0201; Tolerance: ±1%
U5 = CMP-019-00054-1: LDO Regulator Pos 1.2V to 3.3V 1.2A 10-Pin LFCSP EP T/R

## Sheet ADP151-1V8.SchDoc
size A3
Used 2 times, as channels U_Clocking/SUPPLY3, U_Clocking/SUPPLY4. Parts and nets are listed once, with the designators drawn on the sheet.
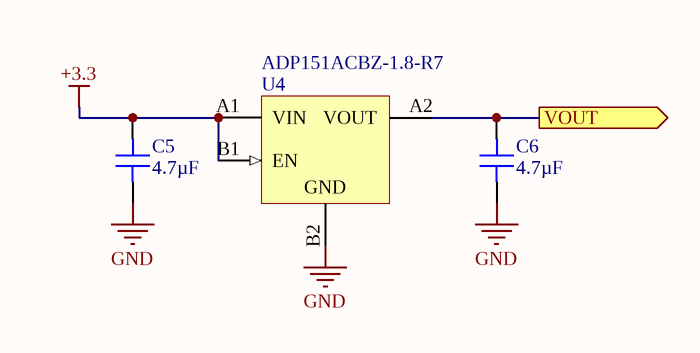
[diagram p4: ADP151-1V8.SchDoc]

### Parts
C5  4.7µF  [CAP 0402_1005]
C6  4.7µF  [CAP 0402_1005]
U4  ADP151ACBZ-1.8-R7  [ADI-CB-4-3]

### Ports
VOUT (out)

### Nets
+3.3: C5.2 U4.A1(VIN) U4.B1(EN)
GND: C5.1 C6.1 U4.B2(GND)
VOUT: C6.2 U4.A2(VOUT) ; port VOUT

### Channels
U_Clocking/SUPPLY3: designators end in _SUPPLY5; ports VOUT=1V8_OUT3
U_Clocking/SUPPLY4: designators end in _SUPPLY4; ports VOUT=1V8_OUT0

### Library data of the parts
C5 C6 = GRM155R61A475MEAAD: as C9 on sheet ADP7157-1V8; Part Number: GRM155R61A475MEAAD; Value: 4.7µF; Applications: General Purpose; Capacitance: 4.7µF; ComponentLink1Description: Datasheet; ComponentLink1URL: https://search.murata.co.jp/Ceramy/image/img/A01X/G101/ENG/GRM155R61A475MEAA-01.pdf; ComponentLink2Description: DigiKey Link; ComponentLink2URL: https://www.digikey.com/en/products/detail/murata-electronics/GRM155R61A475MEAAD/6234735; Device Package: 0402 (1005 Metric); LastUpdated: 2/8/2022 12:26:50 PM; Lifecycle Status: Active; Minimum Order: 1; Mounting Type: Surface Mount, MLCC; Operating Temperature: -55°C ~ 85°C; Package / Case: 0402 (1005 Metric); Packaging: TapeAndReel; PartId: 6746; Part Status: Active; Price: 0.03; Series: GRM; Size / Dimension: 0.039" L x 0.020" W (1.00mm x 0.50mm); Supplier 1: DigiKey; Supplier Part Number 1: 490-14306-1-ND; Temperature Coefficient: X5R; Thickness (Max): 0.026" (0.65mm); Voltage - Rated: 10V
U4 = CMP-0786-00016-1: Ultralow Noise, 200 mA, CMOS Linear Regulator, 2.2 to 5.5 V Vin, 1.8 V Vout, Industrial, 4-pin BGA (CB-4-3), Reel; Manufacturer: Analog Devices; Iout max: 200mA; Vin (max) (V): 5.5; Preset Vout Values (V): 1.8; Vin (min) (V): 2.2; Supply Current IGND @ Small Load: 10uA; ComponentLink3Description: Package Specification; Packing: Reel; Mounting Technology: Surface Mount; ComponentLink1Description: Manufacturer URL; PackageReference: CB-4-3; ComponentLink3URL: http:/www.analog.com/static/imported-files/packages/PKG_PDF/WLCSP(CB)/CB_4_3.pdf; ComponentLink4Description: URL Link1; ComponentLink2URL: http://www.analog.com/static/imported-files/data_sheets/ADP151.pdf; PackageVersion: 011409-A, 01/2009; ComponentLink2Description: Datasheet; PartNumber: ADP151ACBZ-1.8-R7; ComponentLink1URL: http://www.analog.com/en/index.html; PackageDescription: 4-Ball Wafer Level Chip Scale Package, Body 0.76 x 0.76 mm, Pitch 0.4 mm; ComponentLink4URL: Product URL:http://www.analog.com/en/ADP151/productSearch.html; DatasheetVersion: Rev. E

## Sheet SZG-TEMPLATE-TXR.SchDoc: SZG-TEMPLATE-TXR
size B; Organization: Opal Kelly; Address1: 13500 SW 72nd Ave STE 100; Address2: Portland, OR  97223; Address3: 217.391.3724; Address4: http://www.opalkelly.com; DocumentNumber: xxx; Revision: 1; SheetNumber: 3; SheetTotal: 8; PageSetup: Record=PageOptions|CenterHorizontal=True|CenterVertical=True|PrintScale=0.52|XCorrection=1.00|YCorrection=1.00|PrintKind=0|BorderSize=5000000|LeftOffset=0|BottomOffset=0|Orientation=2|PaperLength=1000|PaperWidth=1000|Scale=100|PaperSource=7|PrintQuality=-4|MediaType=1|DitherType=10|PaperKind=Letter|PrintScaleMode=1
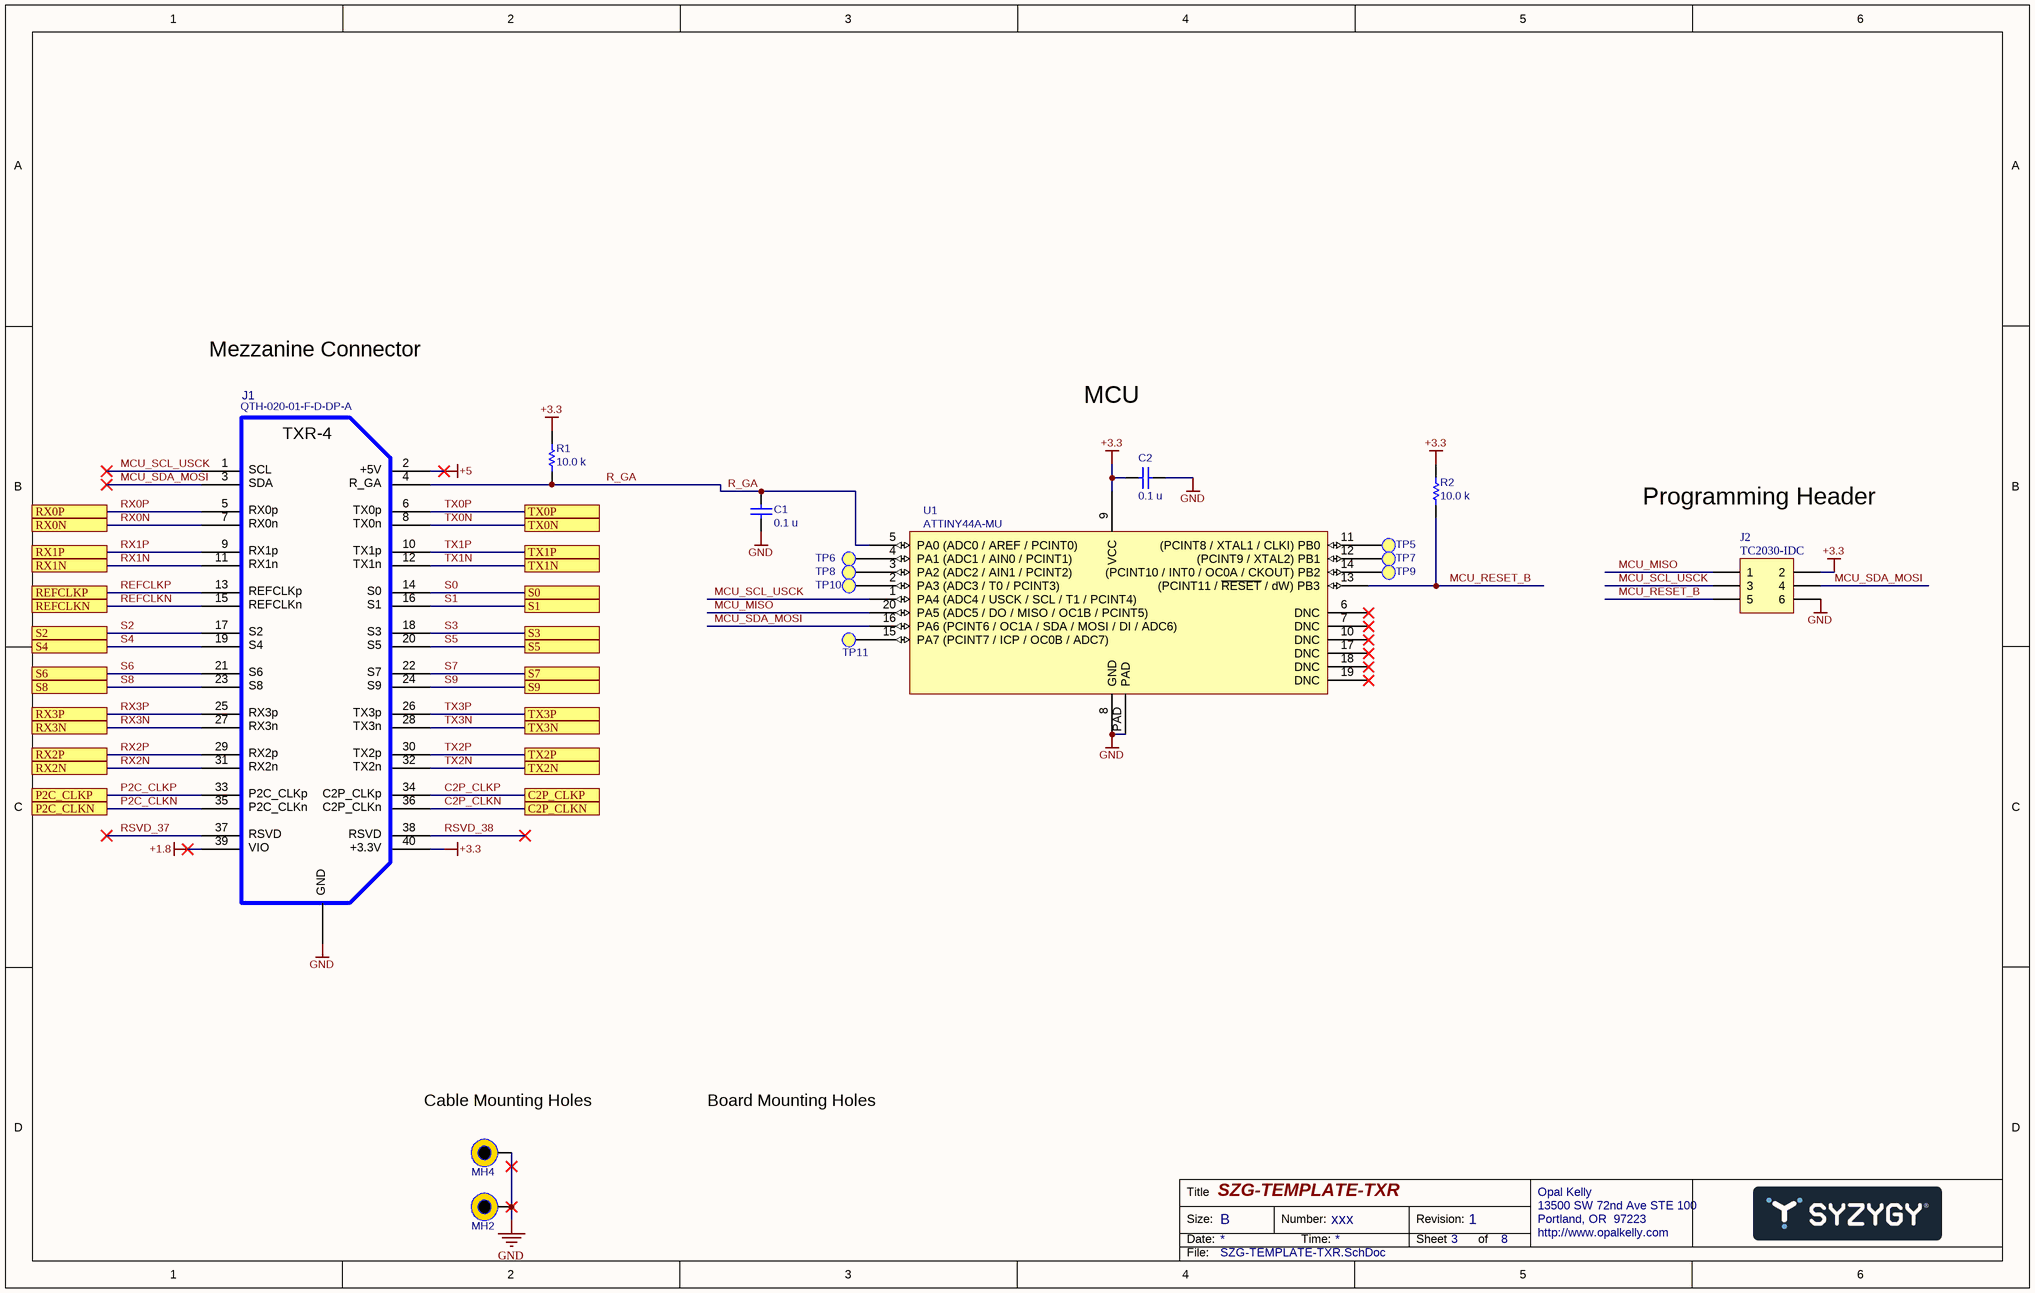
[diagram p5: SZG-TEMPLATE-TXR.SchDoc]

### Parts
C1  value 0.1 u  [CAPC1005X06N]  (hidden comment: C0402C104K8PACTU)
C2  value 0.1 u  [CAPC1005X06N]  (hidden comment: C0402C104K8PACTU)
J1  manufacturer_pn: QTH-020-01-F-D-DP-A  [QTH-020-01-X-D-DP-A-L]  (hidden comment: 40-pin, ground protection in middle)
J2  Manufacturer_PN: TC2030-IDC  [TC2030-DUAL]
MH2  MTG  [MTG-3.2/6.5-PTH]  (value not drawn)
MH4  MTG  [MTG-3.2/6.5-PTH]  (value not drawn)
R1  value 10.0 k  [RESC1005X06N]  (hidden comment: CRCW040210K0FKED)
R2  value 10.0 k  [RESC1005X06N]  (hidden comment: CRCW040210K0FKED)
TP5  TESTPOINT-SMD20  [TP-SMD20]  (value not drawn)
TP6  TESTPOINT-SMD20  [TP-SMD20]  (value not drawn)
TP7  TESTPOINT-SMD20  [TP-SMD20]  (value not drawn)
TP8  TESTPOINT-SMD20  [TP-SMD20]  (value not drawn)
TP9  TESTPOINT-SMD20  [TP-SMD20]  (value not drawn)
TP10  TESTPOINT-SMD20  [TP-SMD20]  (value not drawn)
TP11  TESTPOINT-SMD20  [TP-SMD20]  (value not drawn)
U1  ATTINY44A-MU  [QFN-EP-20]

### Ports
C2P_CLKN, C2P_CLKP, P2C_CLKN, P2C_CLKP, REFCLKN, REFCLKP, RX0N, RX0P, RX1N, RX1P, RX2N, RX2P, RX3N, RX3P, S0, S1, S2, S3, S4, S5, S6, S7, S8, S9, TX0N, TX0P, TX1N, TX1P, TX2N, TX2P, TX3N, TX3P

### Nets
+1.8: J1.39
+3.3: C2.2 J1.40 J2.2 R1.2 R2.2 U1.9(VCC)
+5: J1.2
GND: C1.1 C2.1 J1.0(GND) J2.6 MH2.1 MH4.1 U1.8(GND) U1.PAD
C2P_CLKN: J1.36 ; port C2P_CLKN
C2P_CLKP: J1.34 ; port C2P_CLKP
MCU_MISO: J2.1 U1.20(PA5_(ADC5_/_DO_/_MISO_/_OC1B_/_PCINT5))  [project net MCU_MISO_3]
MCU_RESET_B: J2.5 R2.1 U1.13((PCINT11_/_~{RESET}_/_dW)_PB3)  [project net MCU_RESET_B_3]
MCU_SCL_USCK: J1.1 J2.3 U1.1(PA4_(ADC4_/_USCK_/_SCL_/_T1_/_PCINT4))  [project net MCU_SCL_USCK_3]
MCU_SDA_MOSI: J1.3 J2.4 U1.16(PA6_(PCINT6_/_OC1A_/_SDA_/_MOSI_/_DI_/_ADC6))  [project net MCU_SDA_MOSI_3]
P2C_CLKN: J1.35 ; port P2C_CLKN
P2C_CLKP: J1.33 ; port P2C_CLKP
R_GA: C1.2 J1.4 R1.1 U1.5(PA0_(ADC0_/_AREF_/_PCINT0))  [project net R_GA_3]
REFCLKN: J1.15 ; port REFCLKN  [project net REFCLK_N]
REFCLKP: J1.13 ; port REFCLKP  [project net REFCLK_P]
RSVD_37: J1.37  [project net RSVD_37_3]
RSVD_38: J1.38  [project net RSVD_38_3]
RX0N: J1.7 ; port RX0N  [project net RX0_N]
RX0P: J1.5 ; port RX0P  [project net RX0_P]
RX1N: J1.11 ; port RX1N  [project net RX1_N]
RX1P: J1.9 ; port RX1P  [project net RX1_P]
RX2N: J1.31 ; port RX2N  [project net RX2_N]
RX2P: J1.29 ; port RX2P  [project net RX2_P]
RX3N: J1.27 ; port RX3N  [project net RX3_N]
RX3P: J1.25 ; port RX3P  [project net RX3_P]
S0: J1.14 ; port S0  [project net EN_2]
S1: J1.16 ; port S1  [project net PGOOD_2]
S2: J1.17 ; port S2  [project net SDO]
S3: J1.18 ; port S3  [project net EN_1]
S4: J1.19 ; port S4  [project net XCE_2]
S5: J1.20 ; port S5  [project net PGOOD_1]
S6: J1.21 ; port S6  [project net XCE_1]
S7: J1.22 ; port S7  [project net SDI]
S8: J1.23 ; port S8  [project net XCE_CLK]
S9: J1.24 ; port S9  [project net SCLK]
TX0N: J1.8 ; port TX0N
TX0P: J1.6 ; port TX0P
TX1N: J1.12 ; port TX1N
TX1P: J1.10 ; port TX1P
TX2N: J1.32 ; port TX2N
TX2P: J1.30 ; port TX2P
TX3N: J1.28 ; port TX3N
TX3P: J1.26 ; port TX3P
NetTP5_1: TP5.1(PIN) U1.11((PCINT8_/_XTAL1_/_CLKI)_PB0)
NetTP6_1: TP6.1(PIN) U1.4(PA1_(ADC1_/_AIN0_/_PCINT1))
NetTP7_1: TP7.1(PIN) U1.12((PCINT9_/_XTAL2)_PB1)
NetTP8_1: TP8.1(PIN) U1.3(PA2_(ADC2_/_AIN1_/_PCINT2))
NetTP9_1: TP9.1(PIN) U1.14((PCINT10_/_INT0_/_OC0A_/_CKOUT)_PB2)
NetTP10_1: TP10.1(PIN) U1.2(PA3_(ADC3_/_T0_/_PCINT3))
NetTP11_1: TP11.1(PIN) U1.15(PA7_(PCINT7_/_ICP_/_OC0B_/_ADC7))

Not connected (* = marked no-connect by the designer): U1 6(DNC)* 7(DNC)* 10(DNC)* 17(DNC)* 18(DNC)* 19(DNC)*

### Notes on the sheet
- Mezzanine Connector
- MCU
- Programming Header
- (near MH4) Cable Mounting Holes
- Board Mounting Holes
- Title
- Size:
- Date:
- B
- Number:
- Time:
- Revision:
- Sheet
- of
- File:
- (in symbol 001605) TXR-4; SCL; +5V; SDA; R_GA; RX0p; TX0p; RX0n; TX0n; RX1p; TX1p; RX1n; TX1n; REFCLKp; S0; REFCLKn; S1; S2; S3; S4; S5; S6; S7; S8; S9; RX3p; TX3p; RX3n; TX3n; RX2p; TX2p; RX2n; TX2n; P2C_CLKp; C2P_CLKp; P2C_CLKn; C2P_CLKn; RSVD; VIO; +3.3V

### Library data of the parts
C1 C2 = 000070: Ceramic capacitor; Manufacturer: Kemet; partnumber: 000070; Description 2: SM-0402, 10%, 10v; ValueFloat: 1E-7; Tolerance (%): 10; Manufacturer_PN: C0402C104K8PACTU
  C1: updated_on: 5/15/2017 4:50:04 PM
  C2: updated_on: 11/17/2016 12:16:56 PM
J1 = 001605: 0.5mm hi-speed, high-density header (female); manufacturer: Samtec; AligniPartNumber: 001605; parttype: Connector
J2 = 002062: Tag-Connect 6-pin Plug-of-Nails spring-pin cable footprint; AligniPartNumber: 002062; Manufacturer: Tag-Connect; parttype: Connector
MH2 MH4 = MTG: Mounting hole
R1 R2 = 001521: Thick-film resistor; Manufacturer: Vishay; partnumber: 001521; Description 2: SM-0402, 1%, 1/16W; ValueFloat: 10000; Tolerance (%): 1; x_lifecycle_status: Production; Manufacturer_PN: CRCW040210K0FKED; updated_on: 3/21/2017 2:29:49 PM
TP5-TP11 = TESTPOINT-SMD20: Test point, surface-mount, 20mil
U1 = 001552: 8-bit MCU, 4 KB flash, 256 bytes EEPROM; Manufacturer: Microchip; partnumber: 001552; x_lifecycle_status: Production; Manufacturer_PN: ATTINY44A-MU; updated_on: 5/23/2017 10:51:21 AM

## Sheet SZG-TEMPLATE-STD.SchDoc: SZG-TEMPLATE-STD
size B; Organization: Opal Kelly; Address1: 13500 SW 72nd Ave STE 100; Address2: Portland, OR  97223; Address3: 217.391.3724; Address4: http://www.opalkelly.com; DocumentNumber: xxx; Revision: 1; SheetNumber: 2; SheetTotal: 8; PageSetup: Record=PageOptions|CenterHorizontal=True|CenterVertical=True|PrintScale=0.52|XCorrection=1.00|YCorrection=1.00|PrintKind=0|BorderSize=5000000|LeftOffset=0|BottomOffset=0|Orientation=2|PaperLength=1000|PaperWidth=1000|Scale=100|PaperSource=7|PrintQuality=-4|MediaType=1|DitherType=10|PaperKind=Letter|PrintScaleMode=1
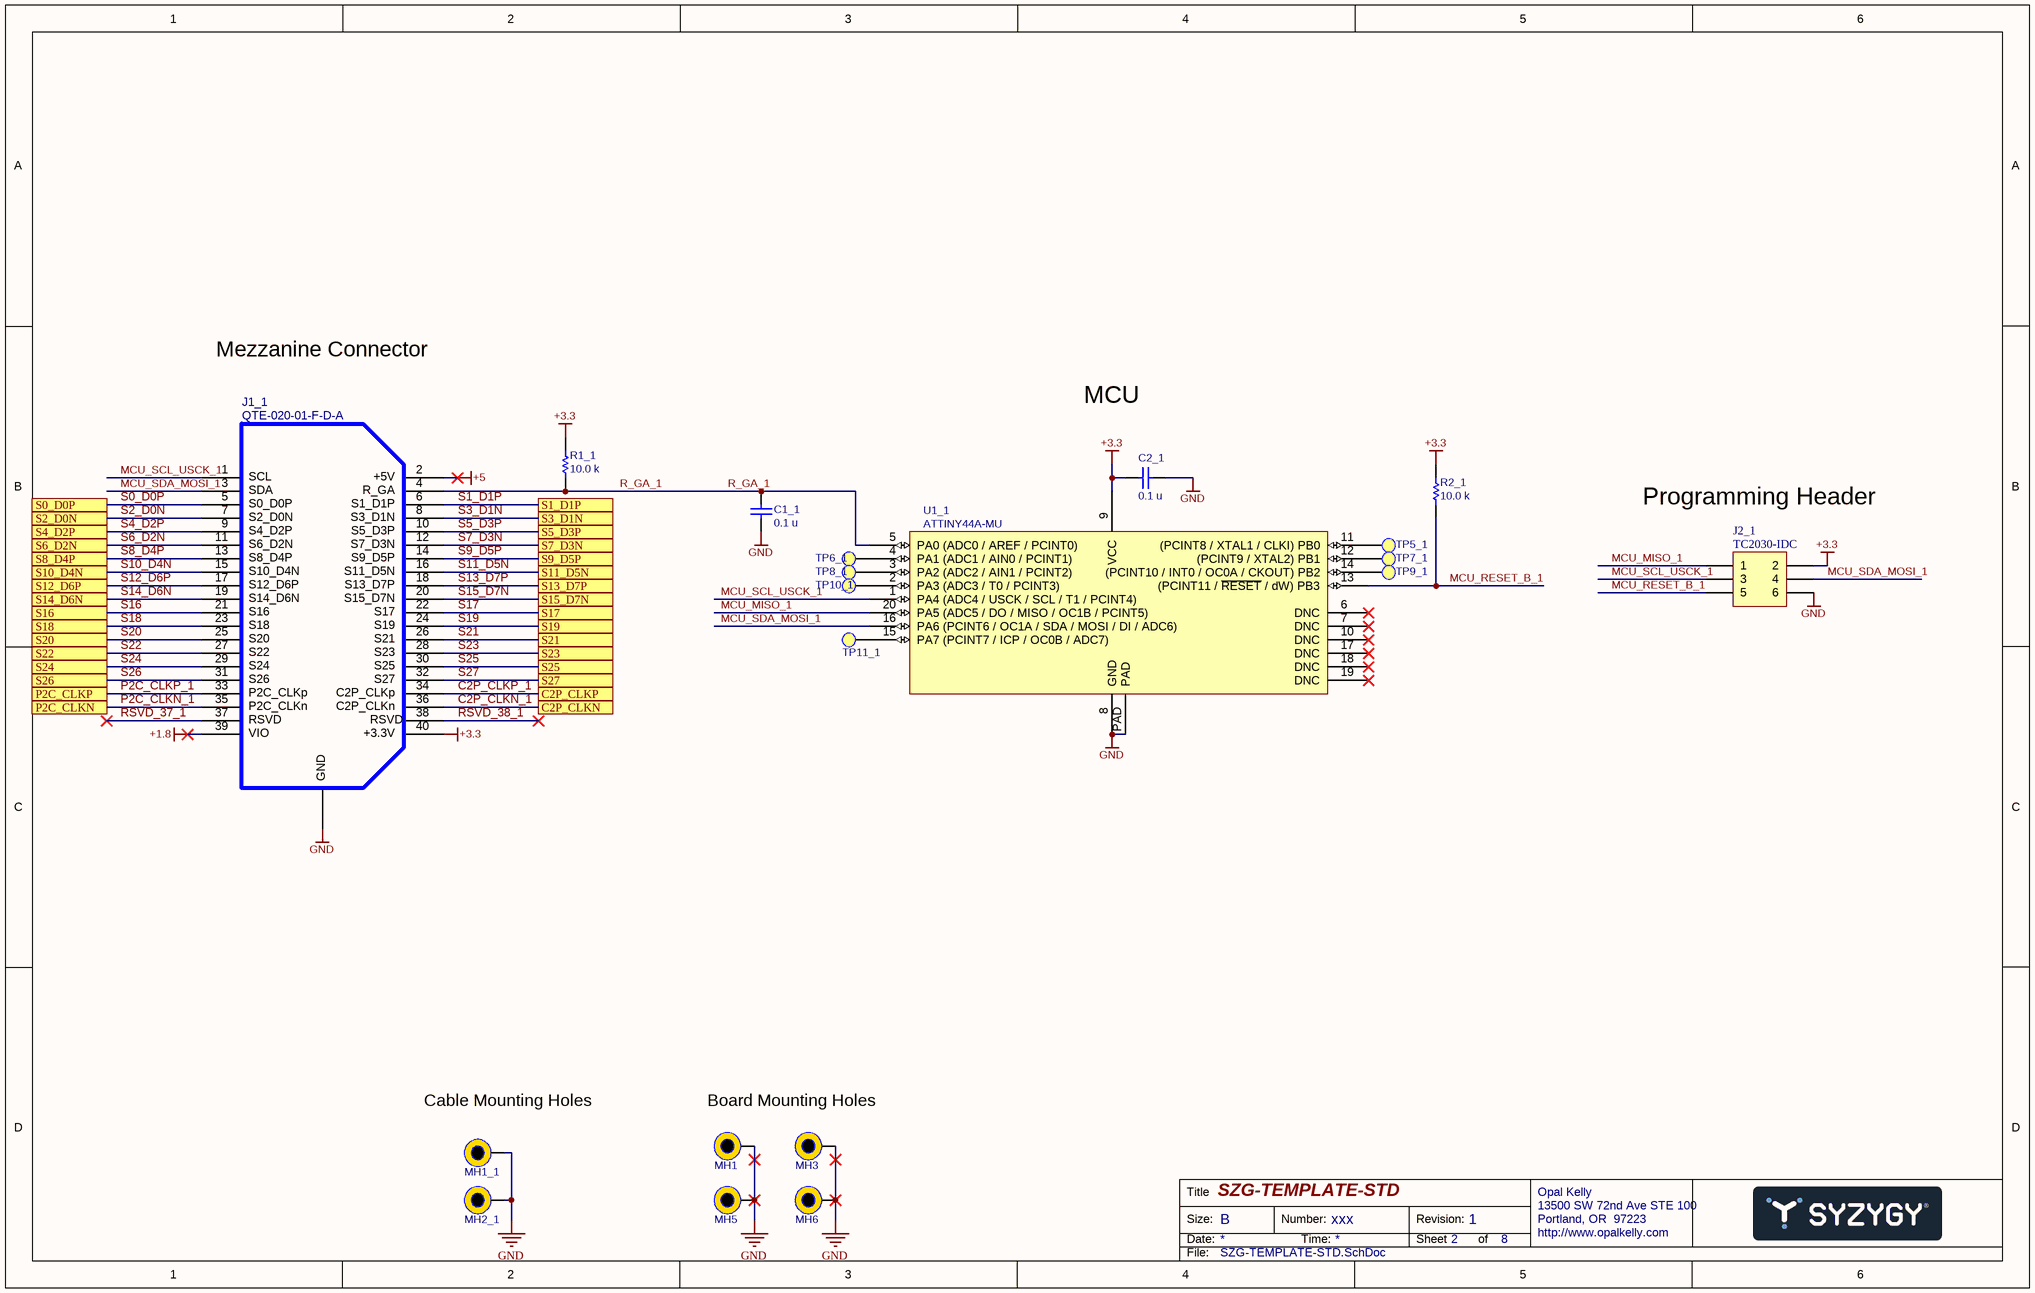
[diagram p6: SZG-TEMPLATE-STD.SchDoc]

### Parts
C1_1  value 0.1 u  [CAPC1005X06N]  (hidden comment: C0402C104K8PACTU)
C2_1  value 0.1 u  [CAPC1005X06N]  (hidden comment: C0402C104K8PACTU)
J1_1  QTE-020-01-F-D-A  [QTE-020-01-X-D-A-L]
J2_1  Manufacturer_PN: TC2030-IDC  [TC2030-DUAL]
MH1  MTG  [MTG-3.2/6.5-PTH]  (value not drawn)
MH1_1  MTG  [MTG-3.2/6.5-PTH]  (value not drawn)
MH2_1  MTG  [MTG-3.2/6.5-PTH]  (value not drawn)
MH3  MTG  [MTG-3.2/6.5-PTH]  (value not drawn)
MH5  MTG  [MTG-3.2/6.5-PTH]  (value not drawn)
MH6  MTG  [MTG-3.2/6.5-PTH]  (value not drawn)
R1_1  value 10.0 k  [RESC1005X06N]  (hidden comment: CRCW040210K0FKED)
R2_1  value 10.0 k  [RESC1005X06N]  (hidden comment: CRCW040210K0FKED)
TP5_1  TESTPOINT-SMD20  [TP-SMD20]  (value not drawn)
TP6_1  TESTPOINT-SMD20  [TP-SMD20]  (value not drawn)
TP7_1  TESTPOINT-SMD20  [TP-SMD20]  (value not drawn)
TP8_1  TESTPOINT-SMD20  [TP-SMD20]  (value not drawn)
TP9_1  TESTPOINT-SMD20  [TP-SMD20]  (value not drawn)
TP10_1  TESTPOINT-SMD20  [TP-SMD20]  (value not drawn)
TP11_1  TESTPOINT-SMD20  [TP-SMD20]  (value not drawn)
U1_1  ATTINY44A-MU  [QFN-EP-20]

### Ports
C2P_CLKN, C2P_CLKP, P2C_CLKN, P2C_CLKP, S0_D0P, S1_D1P, S2_D0N, S3_D1N, S4_D2P, S5_D3P, S6_D2N, S7_D3N, S8_D4P, S9_D5P, S10_D4N, S11_D5N, S12_D6P, S13_D7P, S14_D6N, S15_D7N, S16, S17, S18, S19, S20, S21, S22, S23, S24, S25, S26, S27

### Nets
+1.8: J1_1.39
+3.3: C2_1.2 J1_1.40 J2_1.2 R1_1.2 R2_1.2 U1_1.9(VCC)
+5: J1_1.2
GND: C1_1.1 C2_1.1 J1_1.0 J2_1.6 MH1.1 MH1_1.1 MH2_1.1 MH3.1 MH5.1 MH6.1 U1_1.8(GND) U1_1.PAD
C2P_CLKN_1: J1_1.36 ; port C2P_CLKN
C2P_CLKP_1: J1_1.34 ; port C2P_CLKP
MCU_MISO_1: J2_1.1 U1_1.20(PA5_(ADC5_/_DO_/_MISO_/_OC1B_/_PCINT5))  [project net MCU_MISO_1_2]
MCU_RESET_B_1: J2_1.5 R2_1.1 U1_1.13((PCINT11_/_~{RESET}_/_dW)_PB3)  [project net MCU_RESET_B_1_2]
MCU_SCL_USCK_1: J1_1.1 J2_1.3 U1_1.1(PA4_(ADC4_/_USCK_/_SCL_/_T1_/_PCINT4))  [project net MCU_SCL_USCK_1_2]
MCU_SDA_MOSI_1: J1_1.3 J2_1.4 U1_1.16(PA6_(PCINT6_/_OC1A_/_SDA_/_MOSI_/_DI_/_ADC6))  [project net MCU_SDA_MOSI_1_2]
P2C_CLKN_1: J1_1.35 ; port P2C_CLKN
P2C_CLKP_1: J1_1.33 ; port P2C_CLKP
R_GA_1: C1_1.2 J1_1.4 R1_1.1 U1_1.5(PA0_(ADC0_/_AREF_/_PCINT0))  [project net R_GA_1_2]
RSVD_37_1: J1_1.37  [project net RSVD_37_1_2]
RSVD_38_1: J1_1.38  [project net RSVD_38_1_2]
S0_D0P: J1_1.5 ; port S0_D0P  [project net XTRIG2_2]
S1_D1P: J1_1.6 ; port S1_D1P  [project net XTRIG2_1]
S2_D0N: J1_1.7 ; port S2_D0N  [project net XTRIG1_2]
S3_D1N: J1_1.8 ; port S3_D1N  [project net XTRIG1_1]
S4_D2P: J1_1.9 ; port S4_D2P  [project net XHS_2]
S5_D3P: J1_1.10 ; port S5_D3P  [project net XHS_1]
S6_D2N: J1_1.11 ; port S6_D2N  [project net XVS_2]
S7_D3N: J1_1.12 ; port S7_D3N  [project net XVS_1]
S8_D4P: J1_1.13 ; port S8_D4P  [project net XCLR_2]
S9_D5P: J1_1.14 ; port S9_D5P  [project net XCLR_1]
S10_D4N: J1_1.15 ; port S10_D4N  [project net XMASTER_2]
S11_D5N: J1_1.16 ; port S11_D5N  [project net XMASTER_1]
S12_D6P: J1_1.17 ; port S12_D6P  [project net TOUT0_2]
S13_D7P: J1_1.18 ; port S13_D7P  [project net TOUT0_1]
S14_D6N: J1_1.19 ; port S14_D6N  [project net TOUT1_2]
S15_D7N: J1_1.20 ; port S15_D7N  [project net TOUT1_1]
S16: J1_1.21 ; port S16  [project net TOUT2_2]
S17: J1_1.22 ; port S17  [project net TOUT2_1]
S18: J1_1.23 ; port S18  [project net IN_SEL0]
S19: J1_1.24 ; port S19  [project net OEB]
S20: J1_1.25 ; port S20  [project net IN_SEL1]
S21: J1_1.26 ; port S21  [project net RSTB]
S22: J1_1.27 ; port S22
S23: J1_1.28 ; port S23  [project net SYNCB]
S24: J1_1.29 ; port S24
S25: J1_1.30 ; port S25  [project net LOLB]
S26: J1_1.31 ; port S26
S27: J1_1.32 ; port S27
NetTP5_1_1: TP5_1.1(PIN) U1_1.11((PCINT8_/_XTAL1_/_CLKI)_PB0)
NetTP6_1_1: TP6_1.1(PIN) U1_1.4(PA1_(ADC1_/_AIN0_/_PCINT1))
NetTP7_1_1: TP7_1.1(PIN) U1_1.12((PCINT9_/_XTAL2)_PB1)
NetTP8_1_1: TP8_1.1(PIN) U1_1.3(PA2_(ADC2_/_AIN1_/_PCINT2))
NetTP9_1_1: TP9_1.1(PIN) U1_1.14((PCINT10_/_INT0_/_OC0A_/_CKOUT)_PB2)
NetTP10_1_1: TP10_1.1(PIN) U1_1.2(PA3_(ADC3_/_T0_/_PCINT3))
NetTP11_1_1: TP11_1.1(PIN) U1_1.15(PA7_(PCINT7_/_ICP_/_OC0B_/_ADC7))

Not connected (* = marked no-connect by the designer): U1_1 6(DNC)* 7(DNC)* 10(DNC)* 17(DNC)* 18(DNC)* 19(DNC)*

### Notes on the sheet
- Mezzanine Connector
- MCU
- Programming Header
- (near MH1_1) Cable Mounting Holes
- Board Mounting Holes
- Title
- Size:
- Date:
- B
- Number:
- Time:
- Revision:
- Sheet
- of
- File:
- (in symbol 000973) SCL; +5V; SDA; R_GA; S0_D0P; S1_D1P; S2_D0N; S3_D1N; S4_D2P; S5_D3P; S6_D2N; S7_D3N; S8_D4P; S9_D5P; S10_D4N; S11_D5N; S12_D6P; S13_D7P; S14_D6N; S15_D7N; S16; S17; S18; S19; S20; S21; S22; S23; S24; S25; S26; S27; P2C_CLKp; C2P_CLKp; P2C_CLKn; C2P_CLKn; RSVD; VIO; +3.3V; GND

### Library data of the parts
C1_1 C2_1 = 000070: as C1 on sheet SZG-TEMPLATE-TXR; Manufacturer_PN: C0402C104K8PACTU
  C1_1: updated_on: 5/15/2017 4:50:04 PM
  C2_1: updated_on: 11/17/2016 12:16:56 PM
J1_1 = 000973: Partnumber: 000973; manufacturer: Samtec; id: 24153; inventory_price: 3.86; created_on: 4/3/2013 1:34:16 PM; manufacturer_pn: QTE-020-01-F-D-A; parttype: Connector; rohs: 1; updated_on: 2/26/2018 2:13:14 PM
J2_1 = 002062: as J2 on sheet SZG-TEMPLATE-TXR; Manufacturer: Tag-Connect; parttype: Connector
MH1 MH1_1 MH2_1 MH3 MH5 MH6 = MTG: Mounting hole
R1_1 R2_1 = 001521: as R1 on sheet SZG-TEMPLATE-TXR; Manufacturer_PN: CRCW040210K0FKED; updated_on: 3/21/2017 2:29:49 PM
TP5_1 TP6_1 TP7_1 TP8_1 TP9_1 TP10_1 TP11_1 = TESTPOINT-SMD20: Test point, surface-mount, 20mil
U1_1 = 001552: as U1 on sheet SZG-TEMPLATE-TXR; Manufacturer_PN: ATTINY44A-MU; updated_on: 5/23/2017 10:51:21 AM

## Nets that join several sheets
+1.8: SZG-TEMPLATE-TXR (J1.39), SZG-TEMPLATE-STD (J1_1.39)
+3.3: ADP7157-1V8 (C7.2 U5.5 U5.9 U5.10), U_Clocking/SUPPLY3 (C5_SUPPLY5.2 U4_SUPPLY5.A1 U4_SUPPLY5.B1), U_Clocking/SUPPLY4 (C5_SUPPLY4.2 U4_SUPPLY4.A1 U4_SUPPLY4.B1), SZG-TEMPLATE-TXR (6 pins), SZG-TEMPLATE-STD (6 pins)
+5: U_Camera (R8_U_Camera#1.2), SZG-TEMPLATE-TXR (J1.2), SZG-TEMPLATE-STD (J1_1.2), U_Camera (R8_U_Camera#2.2)
GND: Main (R10.1 R11.1), U_Camera (22 pins), Clocking (8 pins), ADP7157-1V8 (7 pins), U_Clocking/SUPPLY3 (C5_SUPPLY5.1 C6_SUPPLY5.1 U4_SUPPLY5.B2), U_Clocking/SUPPLY4 (C5_SUPPLY4.1 C6_SUPPLY4.1 U4_SUPPLY4.B2), SZG-TEMPLATE-TXR (8 pins), SZG-TEMPLATE-STD (12 pins), U_Camera (22 pins)
1V8_OUT0: Clocking (7 pins), U_Clocking/SUPPLY4 (C6_SUPPLY4.2 U4_SUPPLY4.A2)
1V8_OUT3: Clocking (6 pins), U_Clocking/SUPPLY3 (C6_SUPPLY5.2 U4_SUPPLY5.A2)
1V8_PLL: Clocking (C13.2 C16.2 U3.46 U3.60), ADP7157-1V8 (C8.2 U5.1 U5.2 U5.3)
CSB: Main (R34.2), Clocking (U3.19)
EN_1: U_Camera (R14_U_Camera2.1), SZG-TEMPLATE-TXR (J1.18)
EN_2: SZG-TEMPLATE-TXR (J1.14), U_Camera (R14_U_Camera1.1)
IN_SEL0: Main (R25.2), Clocking (U3.3)
IN_SEL0: Main (R25.1), SZG-TEMPLATE-STD (J1_1.23)
IN_SEL1: Main (R26.2), Clocking (U3.4)
IN_SEL1: Main (R26.1), SZG-TEMPLATE-STD (J1_1.25)
INCK1: U_Camera (R24_U_Camera2.1), Clocking (U3.42)
INCK2: Clocking (U3.38), U_Camera (R24_U_Camera1.1)
LOLB: Main (R27.2), Clocking (U3.47)
LOLB: Main (R27.1), SZG-TEMPLATE-STD (J1_1.30)
OEB: Main (R28.2), Clocking (U3.11)
OEB: Main (R28.1), SZG-TEMPLATE-STD (J1_1.24)
OUT3_N: Main (R10.2), Clocking (U3.37)
OUT4_N: Main (R11.2), Clocking (U3.41)
OUT5_N: Main (C14.1), Clocking (U3.44)
OUT5_P: Main (C15.1), Clocking (U3.45)
PGOOD_1: U_Camera (J5_U_Camera2.8), SZG-TEMPLATE-TXR (J1.20)
PGOOD_2: SZG-TEMPLATE-TXR (J1.16), U_Camera (J5_U_Camera1.8)
REFCLK_N: Main (C14.2), SZG-TEMPLATE-TXR (J1.15)
REFCLK_P: Main (C15.2), SZG-TEMPLATE-TXR (J1.13)
RSTB: Main (R29.2), Clocking (U3.6)
RSTB: Main (R29.1), SZG-TEMPLATE-STD (J1_1.26)
RX0_N: U_Camera (C21_U_Camera#1.1), SZG-TEMPLATE-TXR (J1.7)
RX0_P: U_Camera (C20_U_Camera#1.1), SZG-TEMPLATE-TXR (J1.5)
RX1_N: U_Camera (C23_U_Camera#1.1), SZG-TEMPLATE-TXR (J1.11)
RX1_P: U_Camera (C22_U_Camera#1.1), SZG-TEMPLATE-TXR (J1.9)
RX2_N: SZG-TEMPLATE-TXR (J1.31), U_Camera (C23_U_Camera#2.1)
RX2_P: SZG-TEMPLATE-TXR (J1.29), U_Camera (C22_U_Camera#2.1)
RX3_N: SZG-TEMPLATE-TXR (J1.27), U_Camera (C21_U_Camera#2.1)
RX3_P: SZG-TEMPLATE-TXR (J1.25), U_Camera (C20_U_Camera#2.1)
SCLK: Main (R31.2), Clocking (U3.16)
SCLK: Main (R31.1), U_Camera (R5_U_Camera#1.1), SZG-TEMPLATE-TXR (J1.24), U_Camera (R5_U_Camera#2.1)
SDAIO: Main (R32.2), Clocking (U3.18)
SDI: Main (R32.1), U_Camera (R4_U_Camera#1.1), SZG-TEMPLATE-TXR (J1.22), U_Camera (R4_U_Camera#2.1)
SDO: Main (R33.2), Clocking (U3.17)
SDO: Main (R33.1), U_Camera (J5_U_Camera2.12), SZG-TEMPLATE-TXR (J1.17), U_Camera (J5_U_Camera1.12)
SYNCB: Main (R30.2), Clocking (U3.5)
SYNCB: Main (R30.1), SZG-TEMPLATE-STD (J1_1.28)
TOUT0_1: U_Camera (J5_U_Camera2.14), SZG-TEMPLATE-STD (J1_1.18)
TOUT0_2: SZG-TEMPLATE-STD (J1_1.17), U_Camera (J5_U_Camera1.14)
TOUT1_1: U_Camera (J5_U_Camera2.16), SZG-TEMPLATE-STD (J1_1.20)
TOUT1_2: SZG-TEMPLATE-STD (J1_1.19), U_Camera (J5_U_Camera1.16)
TOUT2_1: U_Camera (J5_U_Camera2.18), SZG-TEMPLATE-STD (J1_1.22)
TOUT2_2: SZG-TEMPLATE-STD (J1_1.21), U_Camera (J5_U_Camera1.18)
XCE_1: U_Camera (R17_U_Camera2.1), SZG-TEMPLATE-TXR (J1.21)
XCE_2: SZG-TEMPLATE-TXR (J1.19), U_Camera (R17_U_Camera1.1)
XCE_CLK: Main (R34.1), SZG-TEMPLATE-TXR (J1.23)
XCLR_1: U_Camera (R23_U_Camera2.1), SZG-TEMPLATE-STD (J1_1.14)
XCLR_2: SZG-TEMPLATE-STD (J1_1.13), U_Camera (R23_U_Camera1.1)
XHS_1: U_Camera (R21_U_Camera2.1), SZG-TEMPLATE-STD (J1_1.10)
XHS_2: SZG-TEMPLATE-STD (J1_1.9), U_Camera (R21_U_Camera1.1)
XMASTER_1: U_Camera (R18_U_Camera2.1), SZG-TEMPLATE-STD (J1_1.16)
XMASTER_2: SZG-TEMPLATE-STD (J1_1.15), U_Camera (R18_U_Camera1.1)
XTRIG1_1: U_Camera (R20_U_Camera2.1), SZG-TEMPLATE-STD (J1_1.8)
XTRIG1_2: SZG-TEMPLATE-STD (J1_1.7), U_Camera (R20_U_Camera1.1)
XTRIG2_1: U_Camera (R19_U_Camera2.1), SZG-TEMPLATE-STD (J1_1.6)
XTRIG2_2: SZG-TEMPLATE-STD (J1_1.5), U_Camera (R19_U_Camera1.1)
XVS_1: U_Camera (R22_U_Camera2.1), SZG-TEMPLATE-STD (J1_1.12)
XVS_2: SZG-TEMPLATE-STD (J1_1.11), U_Camera (R22_U_Camera1.1)

## Assembly variants
Default: not fitted C1 J2 J2